# Altium project HW_FPGA_Board.PrjPcb (part 1 of 2)
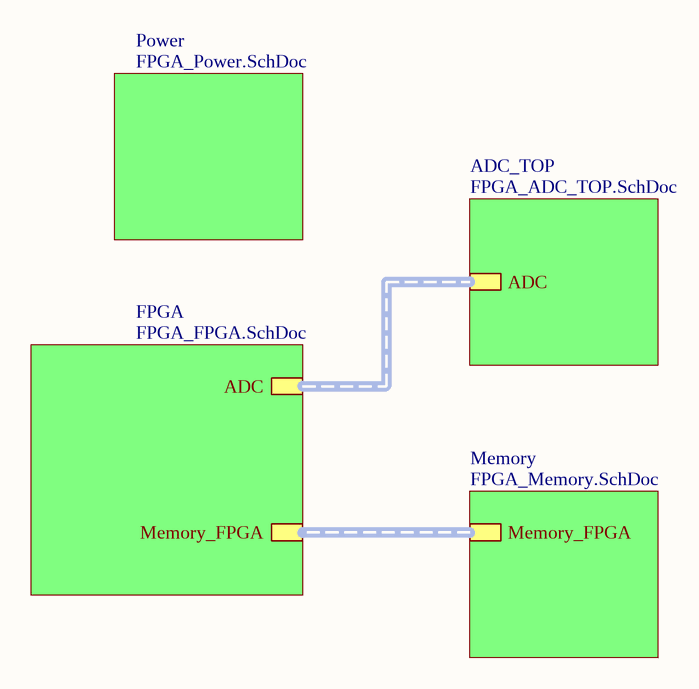
[diagram p0: FPGA_Top.SchDoc]
10 sheets, 242 parts. Net scope: hierarchical (ports join the sheet entries above them; power ports are global).
Board file: HW_FPGA_Board.PcbDoc
Sheets:
  FPGA_Top.SchDoc
    Power = FPGA_Power.SchDoc
    FPGA = FPGA_FPGA.SchDoc
      JTAG = FPGA_JTAG.SchDoc
    ADC_TOP = FPGA_ADC_TOP.SchDoc
      ADC1 = FPGA_ADC1.SchDoc
      ADC2 = FPGA_ADC2.SchDoc
      ADC3 = FPGA_ADC3.SchDoc
      ADC4 = FPGA_ADC4.SchDoc
    Memory = FPGA_Memory.SchDoc

## Sheet FPGA_Top.SchDoc
size A4

### Sub-sheets
ADC_TOP = FPGA_ADC_TOP.SchDoc: ADC (harness ADC_BUS)
FPGA = FPGA_FPGA.SchDoc: Memory_FPGA (harness Memory), ADC (harness Memory)
Memory = FPGA_Memory.SchDoc: Memory_FPGA (harness Memory)
Power = FPGA_Power.SchDoc: no entries

### Buses and harness runs
harness sheet ADC_TOP/ADC = sheet FPGA/ADC
harness sheet FPGA/Memory_FPGA = sheet Memory/Memory_FPGA

## Sheet FPGA_Power.SchDoc
size A3
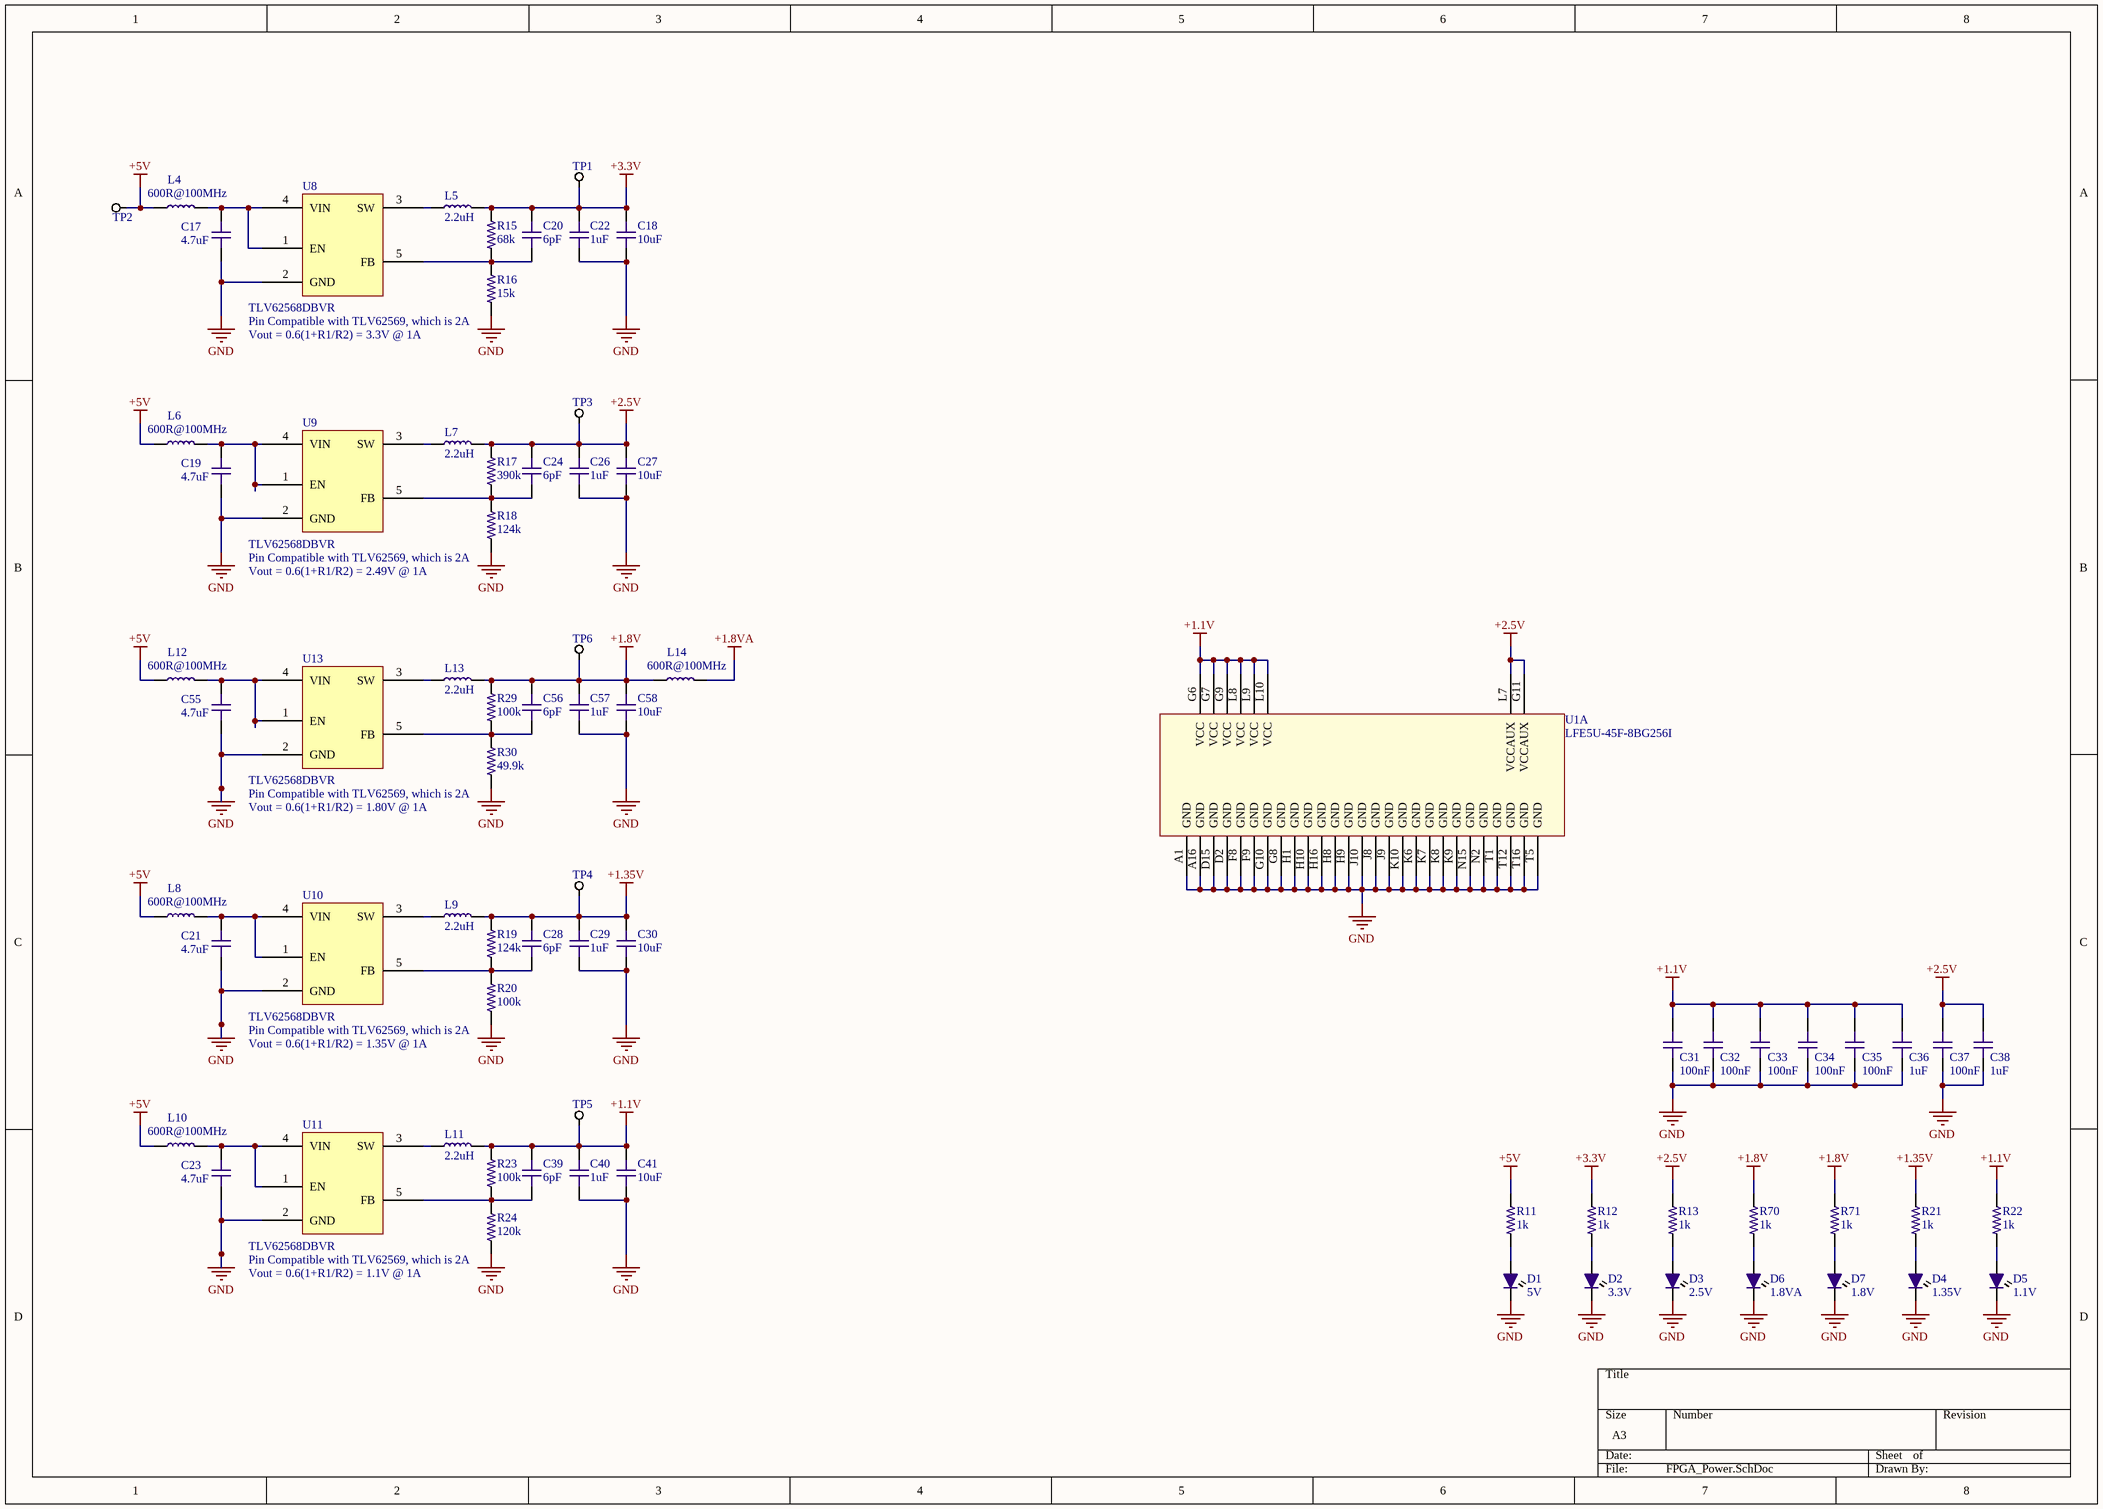
[diagram p1: FPGA_Power.SchDoc]

### Parts
C17  value 4.7uF  [C0603-HIGH-DENSITY]  (hidden comment: 4.7uF, 25V, X5R, 0603)
C18  value 10uF  [C0603-HIGH-DENSITY]  (hidden comment: C0603 10uF 10V X5R)
C19  value 4.7uF  [C0603-HIGH-DENSITY]  (hidden comment: 4.7uF, 25V, X5R, 0603)
C20  value 6pF  [C0603-HIGH-DENSITY]  (hidden comment: CL10C060DB8NNNC)
C21  value 4.7uF  [C0603-HIGH-DENSITY]  (hidden comment: 4.7uF, 25V, X5R, 0603)
C22  value 1uF  [C0603-HIGH-DENSITY]  (hidden comment: C0603 1uF 25V X7R)
C23  value 4.7uF  [C0603-HIGH-DENSITY]  (hidden comment: 4.7uF, 25V, X5R, 0603)
C24  value 6pF  [C0603-HIGH-DENSITY]  (hidden comment: CL10C060DB8NNNC)
C26  value 1uF  [C0603-HIGH-DENSITY]  (hidden comment: C0603 1uF 25V X7R)
C27  value 10uF  [C0603-HIGH-DENSITY]  (hidden comment: C0603 10uF 10V X5R)
C28  value 6pF  [C0603-HIGH-DENSITY]  (hidden comment: CL10C060DB8NNNC)
C29  value 1uF  [C0603-HIGH-DENSITY]  (hidden comment: C0603 1uF 25V X7R)
C30  value 10uF  [C0603-HIGH-DENSITY]  (hidden comment: C0603 10uF 10V X5R)
C31  value 100nF  [C0603-HIGH-DENSITY]  (hidden comment: C0603 100nF 25V X7R)
C32  value 100nF  [C0603-HIGH-DENSITY]  (hidden comment: C0603 100nF 25V X7R)
C33  value 100nF  [C0603-HIGH-DENSITY]  (hidden comment: C0603 100nF 25V X7R)
C34  value 100nF  [C0603-HIGH-DENSITY]  (hidden comment: C0603 100nF 25V X7R)
C35  value 100nF  [C0603-HIGH-DENSITY]  (hidden comment: C0603 100nF 25V X7R)
C36  value 1uF  [C0603-HIGH-DENSITY]  (hidden comment: C0603 1uF 25V X7R)
C37  value 100nF  [C0603-HIGH-DENSITY]  (hidden comment: C0603 100nF 25V X7R)
C38  value 1uF  [C0603-HIGH-DENSITY]  (hidden comment: C0603 1uF 25V X7R)
C39  value 6pF  [C0603-HIGH-DENSITY]  (hidden comment: CL10C060DB8NNNC)
C40  value 1uF  [C0603-HIGH-DENSITY]  (hidden comment: C0603 1uF 25V X7R)
C41  value 10uF  [C0603-HIGH-DENSITY]  (hidden comment: C0603 10uF 10V X5R)
C55  value 4.7uF  [C0603-HIGH-DENSITY]  (hidden comment: 4.7uF, 25V, X5R, 0603)
C56  value 6pF  [C0603-HIGH-DENSITY]  (hidden comment: CL10C060DB8NNNC)
C57  value 1uF  [C0603-HIGH-DENSITY]  (hidden comment: C0603 1uF 25V X7R)
C58  value 10uF  [C0603-HIGH-DENSITY]  (hidden comment: C0603 10uF 10V X5R)
D1  5V  [LED0603-IPC]
D2  3.3V  [LED0603-IPC]
D3  2.5V  [LED0603-IPC]
D4  1.35V  [LED0603-IPC]
D5  1.1V  [LED0603-IPC]
D6  1.8VA  [LED0603-IPC]
D7  1.8V  [LED0603-IPC]
L4  value 600R@100MHz  [L0603]  (hidden comment: Ferrite Bead)
L5  value 2.2uH  [L1008]  (hidden comment: SDEM25201B-2R2MS)
L6  value 600R@100MHz  [L0603]  (hidden comment: Ferrite Bead)
L7  value 2.2uH  [L1008]  (hidden comment: SDEM25201B-2R2MS)
L8  value 600R@100MHz  [L0603]  (hidden comment: Ferrite Bead)
L9  value 2.2uH  [L1008]  (hidden comment: SDEM25201B-2R2MS)
L10  value 600R@100MHz  [L0603]  (hidden comment: Ferrite Bead)
L11  value 2.2uH  [L1008]  (hidden comment: SDEM25201B-2R2MS)
L12  value 600R@100MHz  [L0603]  (hidden comment: Ferrite Bead)
L13  value 2.2uH  [L1008]  (hidden comment: SDEM25201B-2R2MS)
L14  value 600R@100MHz  [L0603]  (hidden comment: Ferrite Bead)
R11  value 1k  [R0603-IPC-1K]  (hidden comment: R0603 1K 1%)
R12  value 1k  [R0603-IPC-1K]  (hidden comment: R0603 1K 1%)
R13  value 1k  [R0603-IPC-1K]  (hidden comment: R0603 1K 1%)
R15  value 68k  [R0603-HIGH-DENSITY]  (hidden comment: R0603 68K 1%)
R16  value 15k  [R0603-HIGH-DENSITY]  (hidden comment: R0603 15K 1%)
R17  value 390k  [R0603-HIGH-DENSITY]  (hidden comment: R0603 390k 0.1%)
R18  value 124k  [R0603-HIGH-DENSITY]  (hidden comment: R0603 124K 1%)
R19  value 124k  [R0603-HIGH-DENSITY]  (hidden comment: R0603 124K 1%)
R20  value 100k  [R0603-HIGH-DENSITY]  (hidden comment: R0603 100K 1%)
R21  value 1k  [R0603-IPC-1K]  (hidden comment: R0603 1K 1%)
R22  value 1k  [R0603-IPC-1K]  (hidden comment: R0603 1K 1%)
R23  value 100k  [R0603-HIGH-DENSITY]  (hidden comment: R0603 100K 1%)
R24  value 120k  [R0603-HIGH-DENSITY]  (hidden comment: R0603 120k 1%)
R29  value 100k  [R0603-HIGH-DENSITY]  (hidden comment: R0603 100K 1%)
R30  value 49.9k  [R0603-HIGH-DENSITY]  (hidden comment: R0603 49.9K 1%)
R70  value 1k  [R0603-IPC-1K]  (hidden comment: R0603 1K 1%)
R71  value 1k  [R0603-IPC-1K]  (hidden comment: R0603 1K 1%)
TP1  3V3  [Testpoint_TH]  (value not drawn)
TP2  5V0  [Testpoint_TH]  (value not drawn)
TP3  2V5  [Testpoint_TH]  (value not drawn)
TP4  1V35  [Testpoint_TH]  (value not drawn)
TP5  1V1  [Testpoint_TH]  (value not drawn)
TP6  1V8  [Testpoint_TH]  (value not drawn)
U1  LFE5U-45F-8BG256I  [caBGA256]  (part A of 9)
U8  TLV62568DBVR  [DBV0005A]
U9  TLV62568DBVR  [DBV0005A]
U10  TLV62568DBVR  [DBV0005A]
U11  TLV62568DBVR  [DBV0005A]
U13  TLV62568DBVR  [DBV0005A]

### Nets
+1.1V: C31.2 C32.2 C33.2 C34.2 C35.2 C36.2 C39.2 C40.2 C41.2 L11.2 R22.2 R23.2 TP5.1 U1.G6(VCC) U1.G7(VCC) U1.G9(VCC) U1.L8(VCC) U1.L9(VCC) U1.L10(VCC)
+1.8V: C56.2 C57.2 C58.2 L13.2 L14.1 R29.2 R70.2 R71.2 TP6.1
+1.8VA: L14.2
+1.35V: C28.2 C29.2 C30.2 L9.2 R19.2 R21.2 TP4.1
+2.5V: C24.2 C26.2 C27.2 C37.2 C38.2 L7.2 R13.2 R17.2 TP3.1 U1.G11(VCCAUX) U1.L7(VCCAUX)
+3.3V: C18.2 C20.2 C22.2 L5.2 R12.2 R15.2 TP1.1
+5V: L4.1 L6.1 L8.1 L10.1 L12.1 R11.2 TP2.1
GND: C17.1 C18.1 C19.1 C21.1 C22.1 C23.1 C26.1 C27.1 C29.1 C30.1 C31.1 C32.1 C33.1 C34.1 C35.1 C36.1 C37.1 C38.1 C40.1 C41.1 C55.1 C57.1 C58.1 D1.K D2.K D3.K D4.K D5.K D6.K D7.K R16.1 R18.1 R20.1 R24.1 R30.1 U1.A1(GND) U1.A16(GND) U1.D2(GND) U1.D15(GND) U1.F8(GND) U1.F9(GND) U1.G8(GND) U1.G10(GND) U1.H1(GND) U1.H8(GND) U1.H9(GND) U1.H10(GND) U1.H16(GND) U1.J8(GND) U1.J9(GND) U1.J10(GND) U1.K6(GND) U1.K7(GND) U1.K8(GND) U1.K9(GND) U1.K10(GND) U1.N2(GND) U1.N15(GND) U1.T1(GND) U1.T5(GND) U1.T12(GND) U1.T16(GND) U8.2(GND) U9.2(GND) U10.2(GND) U11.2(GND) U13.2(GND)
NetC17_2: C17.2 L4.2 U8.1(EN) U8.4(VIN)
NetC19_2: C19.2 L6.2 U9.1(EN) U9.4(VIN)
NetC20_1: C20.1 R15.1 R16.2 U8.5(FB)
NetC21_2: C21.2 L8.2 U10.1(EN) U10.4(VIN)
NetC23_2: C23.2 L10.2 U11.1(EN) U11.4(VIN)
NetC24_1: C24.1 R17.1 R18.2 U9.5(FB)
NetC28_1: C28.1 R19.1 R20.2 U10.5(FB)
NetC39_1: C39.1 R23.1 R24.2 U11.5(FB)
NetC55_2: C55.2 L12.2 U13.1(EN) U13.4(VIN)
NetC56_1: C56.1 R29.1 R30.2 U13.5(FB)
NetD1_A: D1.A R11.1
NetD2_A: D2.A R12.1
NetD3_A: D3.A R13.1
NetD4_A: D4.A R21.1
NetD5_A: D5.A R22.1
NetD6_A: D6.A R70.1
NetD7_A: D7.A R71.1
NetL5_1: L5.1 U8.3(SW)
NetL7_1: L7.1 U9.3(SW)
NetL9_1: L9.1 U10.3(SW)
NetL11_1: L11.1 U11.3(SW)
NetL13_1: L13.1 U13.3(SW)

### Notes on the sheet
- Vout = 0.6(1+R1/R2) = 3.3V @ 1A
- (near R16) Pin Compatible with TLV62569, which is 2A
- Vout = 0.6(1+R1/R2) = 2.49V @ 1A
- (near R18) Pin Compatible with TLV62569, which is 2A
- Vout = 0.6(1+R1/R2) = 1.80V @ 1A
- (near R30) Pin Compatible with TLV62569, which is 2A
- Vout = 0.6(1+R1/R2) = 1.35V @ 1A
- (near R20) Pin Compatible with TLV62569, which is 2A
- (near R24) Pin Compatible with TLV62569, which is 2A
- Vout = 0.6(1+R1/R2) = 1.1V @ 1A

### Library data of the parts
C17 C19 C21 C23 C55 = C0603 4.7uF 25V X5R: Chip Capacitor, 0603, 4.7uF, 25V, X5R; EIA Code: X5R; Max. Voltage: 25V; Supplier 1: Digi-Key; Supplier 2: Mouser; Supplier 3: LCSC; Supplier Part Number 1: 490-7203-1-ND; Supplier Part Number 2: 81-GRM188R61E475KE1D; Supplier Part Number 3: C90057
C18 C27 C30 C41 C58 = C0603 10uF 10V X5R: Chip Capacitor, 0603, 10uF, 10V, X5R; EIA Code: X7R; Max. Voltage: 10V; Supplier 1: Digi-Key; Supplier Part Number 1: 490-10474-1-ND
C20 C24 C28 C39 C56 = C0603 6pF 50V C0G: CAP CER 6PF 50V C0G/NP0 0603; EIA Code: C0G; Max. Voltage: 50V; Supplier 1: Digi-Key; Supplier 2: Mouser; Supplier 3: LCSC; Supplier Part Number 1: 1276-2134-1-ND; Supplier Part Number 2: 187-CL10C060DB8NNNC; Supplier Part Number 3: C170142
C22 C26 C29 C36 C38 C40 C57 = C0603 1uF 25V X7R: CAP CER 1UF 25V X7R 0603; EIA Code: X7R; Max. Voltage: 25V; Features: Soft Termination; Supplier 1: Digi-Key; Supplier Part Number 1: 445-173615-1-ND
C31-C35 C37 = C0603 100nF 25V X7R: Chip Capacitor, 0603, 100nF, 25V, X7R; EIA Code: X7R; Max. Voltage: 25V; Supplier 1: Digi-Key; Supplier Part Number 1: 490-1524-1-ND
D1-D7 = LED 0603 Green: LED GREEN CLEAR 0603 SMD; Supplier 1: Digi-Key; Supplier Part Number 1: 732-4971-1-ND
L4 L6 L8 L10 L12 L14 = FB 0603 600R @ 100MHz: 600 Ohms @ 100MHz 1 Ferrite Bead 0603 (1608 Metric) 500mA 380mOhm; Supplier 1: Digi-Key; Supplier Part Number 1: 490-1014-1-ND
L5 L7 L9 L11 L13 = SDEM25201B-2R2MS: 2.2µH Shielded Inductor 2.05A 117mOhm Max 1008 (2520 Metric); Supplier 1: Digi-Key; Supplier Part Number 1: 2037-SDEM25201B-2R2MSCT-ND
R11-R13 R21 R22 R70 R71 = R0603 1K 1%: RES SMD 1K OHM 1% 1/10W 0603; Temperature Coefficient: ±100ppm/°C; Operating Temperature: -55°C ~ 155°C; Features: Automotive AEC-Q200; Tolerance: ±1%; Supplier 1: Digi-Key; Supplier Part Number 1: RMCF0603FG1K00CT-ND
R15 = R0603 68K 0.1%: RES SMD 68K OHM 1% 1/5W 0603; Supplier 1: Digi-Key; Supplier Part Number 1: P20181CT-ND
R16 = R0603 15K 1%: RES SMD 15K OHM 1% 1/10W 0603; Supplier 1: Digi-Key; Supplier Part Number 1: RMCF0603FT15K0CT-ND
R17 = R0603 390k 0.1%: RES SMD 390K OHM 0.1% 1/10W 0603; Supplier 1: Digi-Key; Supplier Part Number 1: YAG4542CT-ND
R18 R19 = R0603 124K 1%: RES SMD 124K OHM 1% 1/10W 0603; Supplier 1: Digi-Key; Supplier Part Number 1: RMCF0603FT124KCT-ND
R20 R23 R29 = R0603 100K 1%: RES SMD 100K OHM 1% 1/10W 0603; Supplier 1: Digi-Key; Supplier Part Number 1: RMCF0603FT100KCT-ND
R24 = R0603 120k 1%: RES SMD 120K OHM 1% 1/10W 0603; Power: 0.1W; Temperature Coefficient: ±100ppm/°C; Supplier 1: Digi-Key; Tolerance: ±1%; Features: Automotive AEC-Q200; Operating Temperature: -55°C ~ 155°C; Supplier Part Number 1: RMCF0603FT120KCT-ND
R30 = R0603 49.9K 1%: RES SMD 49.9K OHM 1% 1/10W 0603; Temperature Coefficient: ±100ppm/°C; Features: Automotive AEC-Q200; Operating Temperature: -55°C ~ 155°C; Tolerance: ±1%; Supplier 1: Digi-Key; Supplier Part Number 1: RMCF0603FT49K9CT-ND
TP1-TP6 = Testpoint_TH: Through-hole testpoint hook
U1 = ECP5-45F-CABGA256: Lattice ECP5 45k LUTs / IC FPGA 197 I/O 256CABGA; Supplier 1: Digi-Key; Supplier 2: Mouser; Supplier Part Number 1: 220-2201-ND; Supplier Part Number 2: 842-LFE5U45F8BG256I
U8-U11 U13 = TLV62568: IC REG BUCK ADJ 1A SOT23-5; Supplier 1: Digi-Key; Supplier Part Number 1: 296-47359-1-ND

## Sheet FPGA_FPGA.SchDoc
size A2
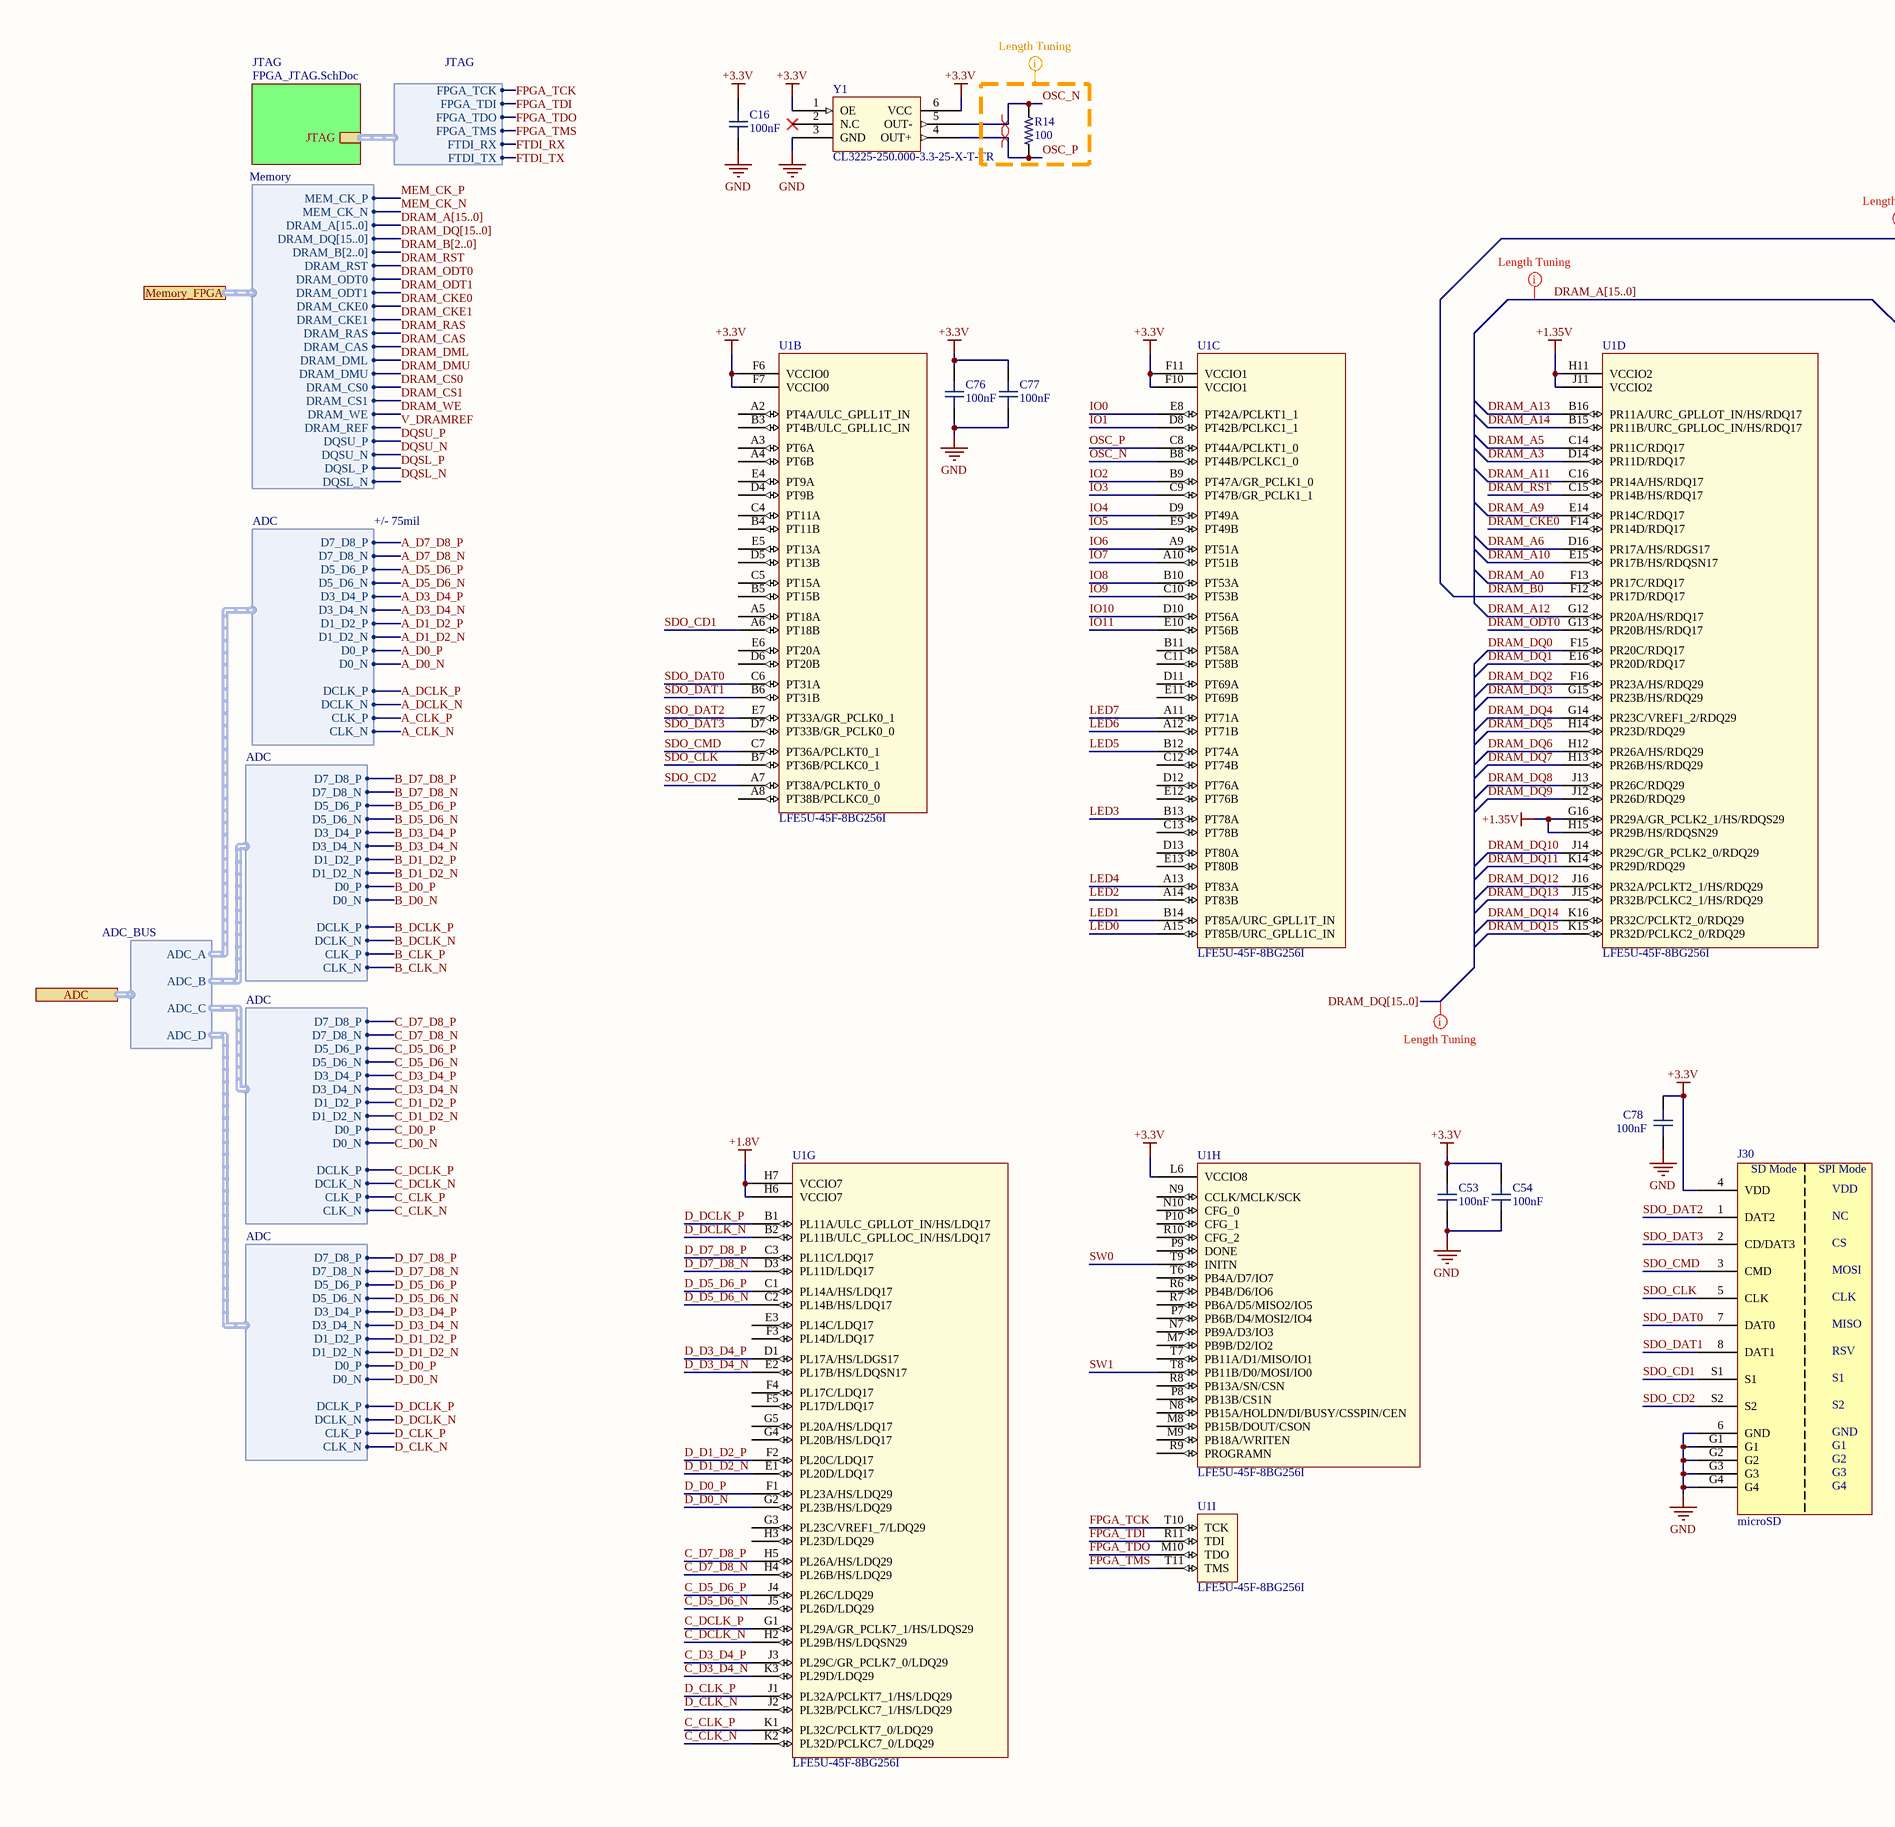
[diagram p2: FPGA_FPGA.SchDoc, left]
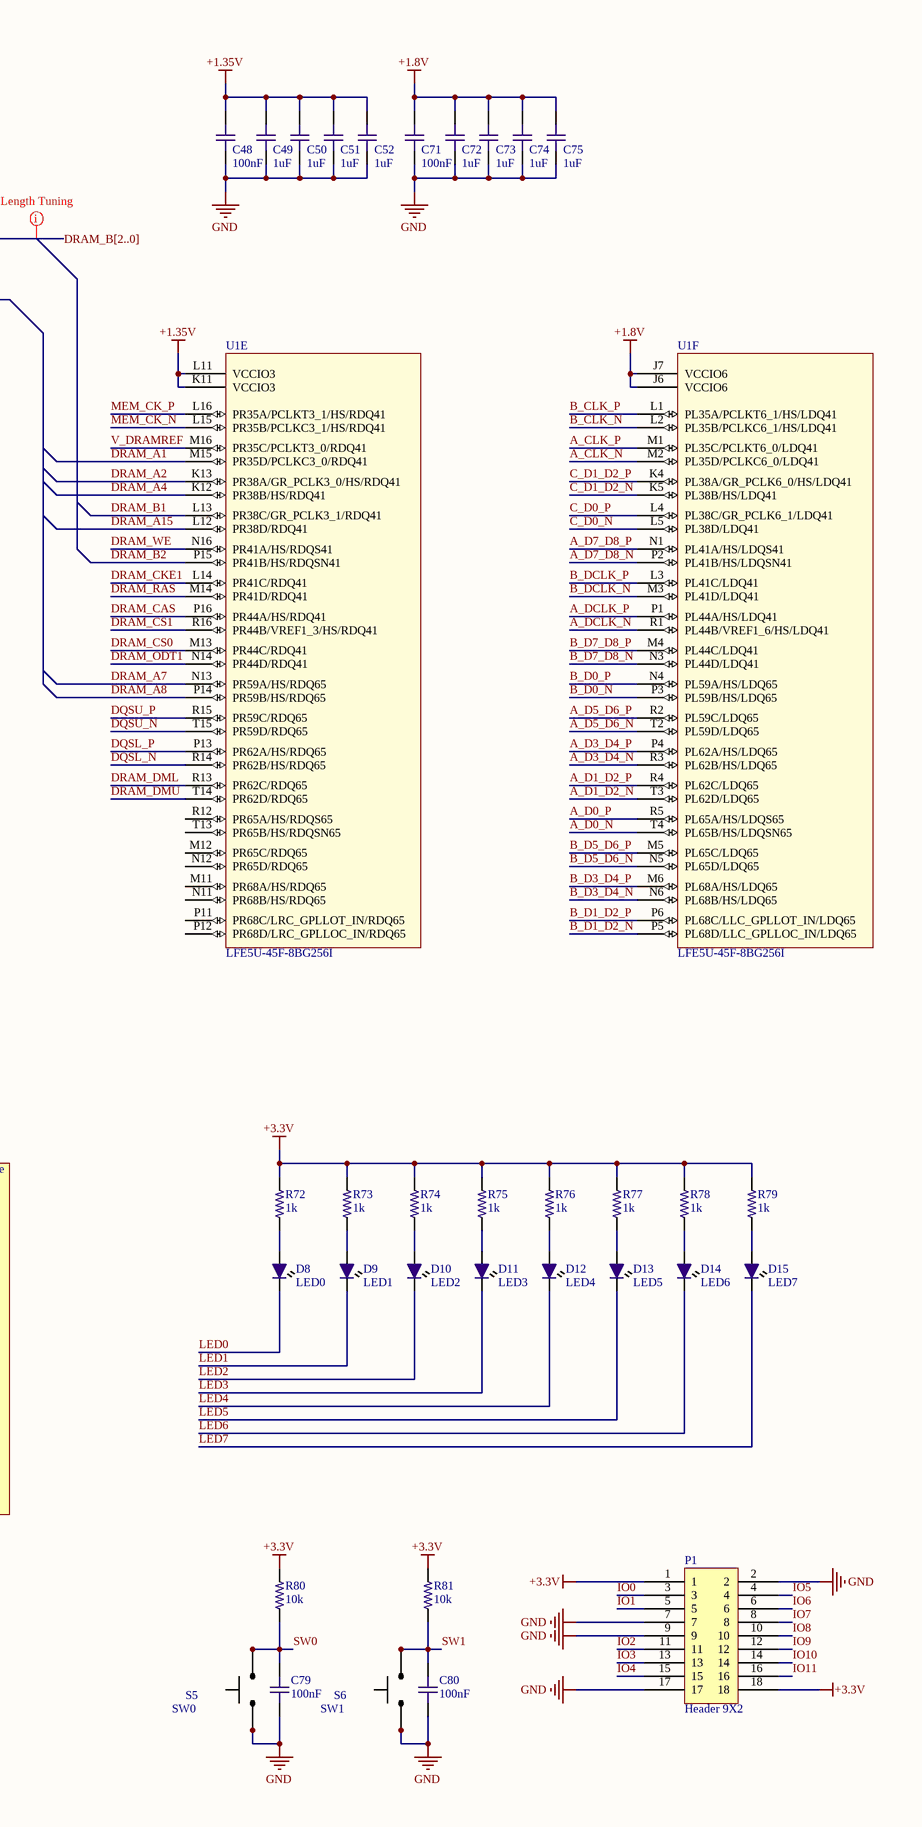
[diagram p3: FPGA_FPGA.SchDoc, right]

### Parts
C16  value 100nF  [C0603-HIGH-DENSITY]  (hidden comment: C0603 100nF 25V X7R)
C48  value 100nF  [C0603-HIGH-DENSITY]  (hidden comment: C0603 100nF 25V X7R)
C49  value 1uF  [C0603-HIGH-DENSITY]  (hidden comment: C0603 1uF 25V X7R)
C50  value 1uF  [C0603-HIGH-DENSITY]  (hidden comment: C0603 1uF 25V X7R)
C51  value 1uF  [C0603-HIGH-DENSITY]  (hidden comment: C0603 1uF 25V X7R)
C52  value 1uF  [C0603-HIGH-DENSITY]  (hidden comment: C0603 1uF 25V X7R)
C53  value 100nF  [C0603-HIGH-DENSITY]  (hidden comment: C0603 100nF 25V X7R)
C54  value 100nF  [C0603-HIGH-DENSITY]  (hidden comment: C0603 100nF 25V X7R)
C71  value 100nF  [C0603-HIGH-DENSITY]  (hidden comment: C0603 100nF 25V X7R)
C72  value 1uF  [C0603-HIGH-DENSITY]  (hidden comment: C0603 1uF 25V X7R)
C73  value 1uF  [C0603-HIGH-DENSITY]  (hidden comment: C0603 1uF 25V X7R)
C74  value 1uF  [C0603-HIGH-DENSITY]  (hidden comment: C0603 1uF 25V X7R)
C75  value 1uF  [C0603-HIGH-DENSITY]  (hidden comment: C0603 1uF 25V X7R)
C76  value 100nF  [C0603-HIGH-DENSITY]  (hidden comment: C0603 100nF 25V X7R)
C77  value 100nF  [C0603-HIGH-DENSITY]  (hidden comment: C0603 100nF 25V X7R)
C78  value 100nF  [C0603-HIGH-DENSITY]  (hidden comment: C0603 100nF 25V X7R)
C79  value 100nF  [C0603-HIGH-DENSITY]  (hidden comment: C0603 100nF 25V X7R)
C80  value 100nF  [C0603-HIGH-DENSITY]  (hidden comment: C0603 100nF 25V X7R)
D8  LED0  [LED0603-IPC]
D9  LED1  [LED0603-IPC]
D10  LED2  [LED0603-IPC]
D11  LED3  [LED0603-IPC]
D12  LED4  [LED0603-IPC]
D13  LED5  [LED0603-IPC]
D14  LED6  [LED0603-IPC]
D15  LED7  [LED0603-IPC]
J30  microSD  [1040310811]
P1  Header 9X2  [Header 9X2]
R14  value 100  [R0402-HIGH-DENSITY]  (hidden comment: R0402 100R 1%)
R72  value 1k  [R0603-IPC]  (hidden comment: R0603 1K 1%)
R73  value 1k  [R0603-IPC]  (hidden comment: R0603 1K 1%)
R74  value 1k  [R0603-IPC]  (hidden comment: R0603 1K 1%)
R75  value 1k  [R0603-IPC]  (hidden comment: R0603 1K 1%)
R76  value 1k  [R0603-IPC]  (hidden comment: R0603 1K 1%)
R77  value 1k  [R0603-IPC]  (hidden comment: R0603 1K 1%)
R78  value 1k  [R0603-IPC]  (hidden comment: R0603 1K 1%)
R79  value 1k  [R0603-IPC]  (hidden comment: R0603 1K 1%)
R80  value 10k  [R0603-IPC]  (hidden comment: R0603 10K 1%)
R81  value 10k  [R0603-IPC]  (hidden comment: R0603 10K 1%)
S5  SW0  [TL3342F260QG]
S6  SW1  [TL3342F260QG]
U1  LFE5U-45F-8BG256I  [caBGA256]  (parts B,C,D,E,F,G,H,I of 9)
Y1  CL3225-250.000-3.3-25-X-T-TR  [Raltron CL3225]

### Sub-sheets
JTAG = FPGA_JTAG.SchDoc: JTAG (harness JTAG)

### Ports
ADC (harness ADC_BUS), Memory_FPGA (harness Memory)

### Harnesses
JTAG: FPGA_TCK, FPGA_TDI, FPGA_TDO, FPGA_TMS, FTDI_RX, FTDI_TX
ADC_BUS: ADC_A, ADC_B, ADC_C, ADC_D
ADC: D7_D8_P, D7_D8_N, D5_D6_P, D5_D6_N, D3_D4_P, D3_D4_N, D1_D2_P, D1_D2_N, D0_P, D0_N, CLK_P, CLK_N, DCLK_P, DCLK_N
Memory: MEM_CK_P, MEM_CK_N, DRAM_A[15..0], DRAM_DQ[15..0], DRAM_B[2..0], DRAM_RST, DRAM_ODT0, DRAM_ODT1, DRAM_CKE0, DRAM_CKE1, DRAM_RAS, DRAM_CAS, DRAM_DML, DRAM_DMU, DRAM_CS0, DRAM_CS1, DRAM_WE, DRAM_REF, DQSU_P, DQSU_N, DQSL_P, DQSL_N

### Nets
+1.8V: C71.2 C72.2 C73.2 C74.2 C75.2 U1.H6(VCCIO7) U1.H7(VCCIO7) U1.J6(VCCIO6) U1.J7(VCCIO6)
+1.35V: C48.2 C49.2 C50.2 C51.2 C52.2 U1.G16(PR29A/GR_PCLK2_1/HS/RDQS29) U1.H11(VCCIO2) U1.H15(PR29B/HS/RDQSN29) U1.J11(VCCIO2) U1.K11(VCCIO3) U1.L11(VCCIO3)
+3.3V: C16.2 C53.2 C54.2 C76.2 C77.2 C78.1 J30.4(VDD) P1.1 P1.18 R72.2 R73.2 R74.2 R75.2 R76.2 R77.2 R78.2 R79.2 R80.2 R81.2 U1.F6(VCCIO0) U1.F7(VCCIO0) U1.F10(VCCIO1) U1.F11(VCCIO1) U1.L6(VCCIO8) Y1.1(OE) Y1.6(VCC)
GND: C16.1 C48.1 C49.1 C50.1 C51.1 C52.1 C53.1 C54.1 C71.1 C72.1 C73.1 C74.1 C75.1 C76.1 C77.1 C78.2 C79.1 C80.1 J30.6(GND) J30.G1 J30.G2 J30.G3 J30.G4 P1.2 P1.7 P1.9 P1.17 S5.3 S5.4 S6.3 S6.4 Y1.3(GND)
A_CLK_N: U1.M2(PL35D/PCLKC6_0/LDQ41) ; harness ADC.CLK_N
A_CLK_P: U1.M1(PL35C/PCLKT6_0/LDQ41) ; harness ADC.CLK_P
A_D0_N: U1.T4(PL65B/HS/LDQSN65) ; harness ADC.D0_N
A_D0_P: U1.R5(PL65A/HS/LDQS65) ; harness ADC.D0_P
A_D1_D2_N: U1.T3(PL62D/LDQ65) ; harness ADC.D1_D2_N
A_D1_D2_P: U1.R4(PL62C/LDQ65) ; harness ADC.D1_D2_P
A_D3_D4_N: U1.R3(PL62B/HS/LDQ65) ; harness ADC.D3_D4_N
A_D3_D4_P: U1.P4(PL62A/HS/LDQ65) ; harness ADC.D3_D4_P
A_D5_D6_N: U1.T2(PL59D/LDQ65) ; harness ADC.D5_D6_N
A_D5_D6_P: U1.R2(PL59C/LDQ65) ; harness ADC.D5_D6_P
A_D7_D8_N: U1.P2(PL41B/HS/LDQSN41) ; harness ADC.D7_D8_N
A_D7_D8_P: U1.N1(PL41A/HS/LDQS41) ; harness ADC.D7_D8_P
A_DCLK_N: U1.R1(PL44B/VREF1_6/HS/LDQ41) ; harness ADC.DCLK_N
A_DCLK_P: U1.P1(PL44A/HS/LDQ41) ; harness ADC.DCLK_P
B_CLK_N: U1.L2(PL35B/PCLKC6_1/HS/LDQ41) ; harness ADC.CLK_N
B_CLK_P: U1.L1(PL35A/PCLKT6_1/HS/LDQ41) ; harness ADC.CLK_P
B_D0_N: U1.P3(PL59B/HS/LDQ65) ; harness ADC.D0_N
B_D0_P: U1.N4(PL59A/HS/LDQ65) ; harness ADC.D0_P
B_D1_D2_N: U1.P5(PL68D/LLC_GPLLOC_IN/LDQ65) ; harness ADC.D1_D2_N
B_D1_D2_P: U1.P6(PL68C/LLC_GPLLOT_IN/LDQ65) ; harness ADC.D1_D2_P
B_D3_D4_N: U1.N6(PL68B/HS/LDQ65) ; harness ADC.D3_D4_N
B_D3_D4_P: U1.M6(PL68A/HS/LDQ65) ; harness ADC.D3_D4_P
B_D5_D6_N: U1.N5(PL65D/LDQ65) ; harness ADC.D5_D6_N
B_D5_D6_P: U1.M5(PL65C/LDQ65) ; harness ADC.D5_D6_P
B_D7_D8_N: U1.N3(PL44D/LDQ41) ; harness ADC.D7_D8_N
B_D7_D8_P: U1.M4(PL44C/LDQ41) ; harness ADC.D7_D8_P
B_DCLK_N: U1.M3(PL41D/LDQ41) ; harness ADC.DCLK_N
B_DCLK_P: U1.L3(PL41C/LDQ41) ; harness ADC.DCLK_P
C_CLK_N: U1.K2(PL32D/PCLKC7_0/LDQ29) ; harness ADC.CLK_N
C_CLK_P: U1.K1(PL32C/PCLKT7_0/LDQ29) ; harness ADC.CLK_P
C_D0_N: U1.L5(PL38D/LDQ41) ; harness ADC.D0_N
C_D0_P: U1.L4(PL38C/GR_PCLK6_1/LDQ41) ; harness ADC.D0_P
C_D1_D2_N: U1.K5(PL38B/HS/LDQ41) ; harness ADC.D1_D2_N
C_D1_D2_P: U1.K4(PL38A/GR_PCLK6_0/HS/LDQ41) ; harness ADC.D1_D2_P
C_D3_D4_N: U1.K3(PL29D/LDQ29) ; harness ADC.D3_D4_N
C_D3_D4_P: U1.J3(PL29C/GR_PCLK7_0/LDQ29) ; harness ADC.D3_D4_P
C_D5_D6_N: U1.J5(PL26D/LDQ29) ; harness ADC.D5_D6_N
C_D5_D6_P: U1.J4(PL26C/LDQ29) ; harness ADC.D5_D6_P
C_D7_D8_N: U1.H4(PL26B/HS/LDQ29) ; harness ADC.D7_D8_N
C_D7_D8_P: U1.H5(PL26A/HS/LDQ29) ; harness ADC.D7_D8_P
C_DCLK_N: U1.H2(PL29B/HS/LDQSN29) ; harness ADC.DCLK_N
C_DCLK_P: U1.G1(PL29A/GR_PCLK7_1/HS/LDQS29) ; harness ADC.DCLK_P
D_CLK_N: U1.J2(PL32B/PCLKC7_1/HS/LDQ29) ; harness ADC.CLK_N
D_CLK_P: U1.J1(PL32A/PCLKT7_1/HS/LDQ29) ; harness ADC.CLK_P
D_D0_N: U1.G2(PL23B/HS/LDQ29) ; harness ADC.D0_N
D_D0_P: U1.F1(PL23A/HS/LDQ29) ; harness ADC.D0_P
D_D1_D2_N: U1.E1(PL20D/LDQ17) ; harness ADC.D1_D2_N
D_D1_D2_P: U1.F2(PL20C/LDQ17) ; harness ADC.D1_D2_P
D_D3_D4_N: U1.E2(PL17B/HS/LDQSN17) ; harness ADC.D3_D4_N
D_D3_D4_P: U1.D1(PL17A/HS/LDGS17) ; harness ADC.D3_D4_P
D_D5_D6_N: U1.C2(PL14B/HS/LDQ17) ; harness ADC.D5_D6_N
D_D5_D6_P: U1.C1(PL14A/HS/LDQ17) ; harness ADC.D5_D6_P
D_D7_D8_N: U1.D3(PL11D/LDQ17) ; harness ADC.D7_D8_N
D_D7_D8_P: U1.C3(PL11C/LDQ17) ; harness ADC.D7_D8_P
D_DCLK_N: U1.B2(PL11B/ULC_GPLLOC_IN/HS/LDQ17) ; harness ADC.DCLK_N
D_DCLK_P: U1.B1(PL11A/ULC_GPLLOT_IN/HS/LDQ17) ; harness ADC.DCLK_P
DQSL_N: U1.R14(PR62B/HS/RDQ65) ; port Memory_FPGA.DQSL_N
DQSL_P: U1.P13(PR62A/HS/RDQ65) ; port Memory_FPGA.DQSL_P
DQSU_N: U1.T15(PR59D/RDQ65) ; port Memory_FPGA.DQSU_N
DQSU_P: U1.R15(PR59C/RDQ65) ; port Memory_FPGA.DQSU_P
DRAM_A0: U1.F13(PR17C/RDQ17)
DRAM_A1: U1.M15(PR35D/PCLKC3_0/RDQ41)
DRAM_A2: U1.K13(PR38A/GR_PCLK3_0/HS/RDQ41)
DRAM_A3: U1.D14(PR11D/RDQ17)
DRAM_A4: U1.K12(PR38B/HS/RDQ41)
DRAM_A5: U1.C14(PR11C/RDQ17)
DRAM_A6: U1.D16(PR17A/HS/RDGS17)
DRAM_A7: U1.N13(PR59A/HS/RDQ65)
DRAM_A8: U1.P14(PR59B/HS/RDQ65)
DRAM_A9: U1.E14(PR14C/RDQ17)
DRAM_A10: U1.E15(PR17B/HS/RDQSN17)
DRAM_A11: U1.C16(PR14A/HS/RDQ17)
DRAM_A12: U1.G12(PR20A/HS/RDQ17)
DRAM_A13: U1.B16(PR11A/URC_GPLLOT_IN/HS/RDQ17)
DRAM_A14: U1.B15(PR11B/URC_GPLLOC_IN/HS/RDQ17)
DRAM_A15: U1.L12(PR38D/RDQ41)
DRAM_B0: U1.F12(PR17D/RDQ17)
DRAM_B1: U1.L13(PR38C/GR_PCLK3_1/RDQ41)
DRAM_B2: U1.P15(PR41B/HS/RDQSN41)
DRAM_CAS: U1.P16(PR44A/HS/RDQ41) ; port Memory_FPGA.DRAM_CAS
DRAM_CKE0: U1.F14(PR14D/RDQ17) ; port Memory_FPGA.DRAM_CKE0
DRAM_CKE1: U1.L14(PR41C/RDQ41) ; port Memory_FPGA.DRAM_CKE1
DRAM_CS0: U1.M13(PR44C/RDQ41) ; port Memory_FPGA.DRAM_CS0
DRAM_CS1: U1.R16(PR44B/VREF1_3/HS/RDQ41) ; port Memory_FPGA.DRAM_CS1
DRAM_DML: U1.R13(PR62C/RDQ65) ; port Memory_FPGA.DRAM_DML
DRAM_DMU: U1.T14(PR62D/RDQ65) ; port Memory_FPGA.DRAM_DMU
DRAM_DQ0: U1.F15(PR20C/RDQ17)
DRAM_DQ1: U1.E16(PR20D/RDQ17)
DRAM_DQ2: U1.F16(PR23A/HS/RDQ29)
DRAM_DQ3: U1.G15(PR23B/HS/RDQ29)
DRAM_DQ4: U1.G14(PR23C/VREF1_2/RDQ29)
DRAM_DQ5: U1.H14(PR23D/RDQ29)
DRAM_DQ6: U1.H12(PR26A/HS/RDQ29)
DRAM_DQ7: U1.H13(PR26B/HS/RDQ29)
DRAM_DQ8: U1.J13(PR26C/RDQ29)
DRAM_DQ9: U1.J12(PR26D/RDQ29)
DRAM_DQ10: U1.J14(PR29C/GR_PCLK2_0/RDQ29)
DRAM_DQ11: U1.K14(PR29D/RDQ29)
DRAM_DQ12: U1.J16(PR32A/PCLKT2_1/HS/RDQ29)
DRAM_DQ13: U1.J15(PR32B/PCLKC2_1/HS/RDQ29)
DRAM_DQ14: U1.K16(PR32C/PCLKT2_0/RDQ29)
DRAM_DQ15: U1.K15(PR32D/PCLKC2_0/RDQ29)
DRAM_ODT0: U1.G13(PR20B/HS/RDQ17) ; port Memory_FPGA.DRAM_ODT0
DRAM_ODT1: U1.N14(PR44D/RDQ41) ; port Memory_FPGA.DRAM_ODT1
DRAM_RAS: U1.M14(PR41D/RDQ41) ; port Memory_FPGA.DRAM_RAS
DRAM_RST: U1.C15(PR14B/HS/RDQ17) ; port Memory_FPGA.DRAM_RST
DRAM_WE: U1.N16(PR41A/HS/RDQS41) ; port Memory_FPGA.DRAM_WE
FPGA_TCK: U1.T10(TCK) ; sheet JTAG/JTAG.FPGA_TCK
FPGA_TDI: U1.R11(TDI) ; sheet JTAG/JTAG.FPGA_TDI
FPGA_TDO: U1.M10(TDO) ; sheet JTAG/JTAG.FPGA_TDO
FPGA_TMS: U1.T11(TMS) ; sheet JTAG/JTAG.FPGA_TMS
IO0: P1.3 U1.E8(PT42A/PCLKT1_1)
IO1: P1.5 U1.D8(PT42B/PCLKC1_1)
IO2: P1.11 U1.B9(PT47A/GR_PCLK1_0)
IO3: P1.13 U1.C9(PT47B/GR_PCLK1_1)
IO4: P1.15 U1.D9(PT49A)
IO5: P1.4 U1.E9(PT49B)
IO6: P1.6 U1.A9(PT51A)
IO7: P1.8 U1.A10(PT51B)
IO8: P1.10 U1.B10(PT53A)
IO9: P1.12 U1.C10(PT53B)
IO10: P1.14 U1.D10(PT56A)
IO11: P1.16 U1.E10(PT56B)
LED0: D8.K U1.A15(PT85B/URC_GPLL1C_IN)
LED1: D9.K U1.B14(PT85A/URC_GPLL1T_IN)
LED2: D10.K U1.A14(PT83B)
LED3: D11.K U1.B13(PT78A)
LED4: D12.K U1.A13(PT83A)
LED5: D13.K U1.B12(PT74A)
LED6: D14.K U1.A12(PT71B)
LED7: D15.K U1.A11(PT71A)
MEM_CK_N: U1.L15(PR35B/PCLKC3_1/HS/RDQ41) ; port Memory_FPGA.MEM_CK_N
MEM_CK_P: U1.L16(PR35A/PCLKT3_1/HS/RDQ41) ; port Memory_FPGA.MEM_CK_P
OSC_N: R14.2 U1.B8(PT44B/PCLKC1_0) Y1.5(OUT-)
OSC_P: R14.1 U1.C8(PT44A/PCLKT1_0) Y1.4(OUT+)
SDO_CD1: J30.S1 U1.A6(PT18B)
SDO_CD2: J30.S2 U1.A7(PT38A/PCLKT0_0)
SDO_CLK: J30.5(CLK) U1.B7(PT36B/PCLKC0_1)
SDO_CMD: J30.3(CMD) U1.C7(PT36A/PCLKT0_1)
SDO_DAT0: J30.7(DAT0) U1.C6(PT31A)
SDO_DAT1: J30.8(DAT1) U1.B6(PT31B)
SDO_DAT2: J30.1(DAT2) U1.E7(PT33A/GR_PCLK0_1)
SDO_DAT3: J30.2(CD/DAT3) U1.D7(PT33B/GR_PCLK0_0)
SW0: C79.2 R80.1 S5.1 S5.2 U1.T9(INITN)
SW1: C80.2 R81.1 S6.1 S6.2 U1.T8(PB11B/D0/MOSI/IO0)
V_DRAMREF: U1.M16(PR35C/PCLKT3_0/RDQ41) ; port Memory_FPGA.DRAM_REF
NetD8_A: D8.A R72.1
NetD9_A: D9.A R73.1
NetD10_A: D10.A R74.1
NetD11_A: D11.A R75.1
NetD12_A: D12.A R76.1
NetD13_A: D13.A R77.1
NetD14_A: D14.A R78.1
NetD15_A: D15.A R79.1

Not connected (* = marked no-connect by the designer): U1 A2(PT4A/ULC_GPLL1T_IN) A3(PT6A) A4(PT6B) A5(PT18A) A8(PT38B/PCLKC0_0) B3(PT4B/ULC_GPLL1C_IN) B4(PT11B) B5(PT15B) B11(PT58A) C4(PT11A) C5(PT15A) C11(PT58B) C12(PT74B) C13(PT78B) D4(PT9B) D5(PT13B) D6(PT20B) D11(PT69A) D12(PT76A) D13(PT80A) E3(PL14C/LDQ17) E4(PT9A) E5(PT13A) E6(PT20A) E11(PT69B) E12(PT76B) E13(PT80B) F3(PL14D/LDQ17) F4(PL17C/LDQ17) F5(PL17D/LDQ17) G3(PL23C/VREF1_7/LDQ29) G4(PL20B/HS/LDQ17) G5(PL20A/HS/LDQ17) H3(PL23D/LDQ29) M7(PB9B/D2/IO2) M8(PB15B/DOUT/CSON) M9(PB18A/WRITEN) M11(PR68A/HS/RDQ65) M12(PR65C/RDQ65) N7(PB9A/D3/IO3) N8(PB15A/HOLDN/DI/BUSY/CSSPIN/CEN) N9(CCLK/MCLK/SCK) N10(CFG_0) N11(PR68B/HS/RDQ65) N12(PR65D/RDQ65) P7(PB6B/D4/MOSI2/IO4) P8(PB13B/CS1N) P9(DONE) P10(CFG_1) P11(PR68C/LRC_GPLLOT_IN/RDQ65) P12(PR68D/LRC_GPLLOC_IN/RDQ65) R6(PB4B/D6/IO6) R7(PB6A/D5/MISO2/IO5) R8(PB13A/SN/CSN) R9(PROGRAMN) R10(CFG_2) R12(PR65A/HS/RDQS65) T6(PB4A/D7/IO7) T7(PB11A/D1/MISO/IO1) T13(PR65B/HS/RDQSN65); Y1 2(N.C)*

### Buses and harness runs
bus DRAM_A[15..0]
bus DRAM_B[2..0]
bus DRAM_DQ[15..0]

### Layout directives
differential pair; net class DIFF100: OSC_N, OSC_P
net class OSC - 37.5mil: OSC_N, OSC_P
net class DRAM_DATA - 150mil: (no net found under the mark)
net class DRAM_B - 150mil: (no net found under the mark)
net class DRAM_ADD - 150mil: (no net found under the mark)

### Notes on the sheet
- +/- 75mil
- (in symbol microSD) SD Mode; SPI Mode; NC; CS; MOSI; MISO; RSV

### Library data of the parts
C16 C48 C53 C54 C71 C76-C80 = C0603 100nF 25V X7R: Chip Capacitor, 0603, 100nF, 25V, X7R; EIA Code: X7R; Max. Voltage: 25V; Supplier 1: Digi-Key; Supplier Part Number 1: 490-1524-1-ND
C49-C52 C72-C75 = C0603 1uF 25V X7R: CAP CER 1UF 25V X7R 0603; EIA Code: X7R; Max. Voltage: 25V; Features: Soft Termination; Supplier 1: Digi-Key; Supplier Part Number 1: 445-173615-1-ND
D8-D15 = LED 0603 Green: LED GREEN CLEAR 0603 SMD; Supplier 1: Digi-Key; Supplier Part Number 1: 732-4971-1-ND
  D8: Value: Green
J30 = microSD: CONN MICRO SD CARD PUSH-PULL R/A; Supplier 1: Digi-Key; Supplier Part Number 1: WM6357CT-ND
P1 = Header 9X2: 0.254mm
R14 = R0402 100R 1%: Chip Resistor, 0402, 100 ohms, 1%, 1/16 W; Supplier 1: Digi-Key; Supplier Part Number 1: 311-100LRCT-ND
R72-R79 = R0603 1K 1%: as R11 on sheet FPGA_Power; Operating Temperature: -55°C ~ 155°C; Features: Automotive AEC-Q200; Tolerance: ±1%; Supplier 1: Digi-Key; Supplier Part Number 1: RMCF0603FG1K00CT-ND
R80 R81 = R0603 10K 1%: RES SMD 10K OHM 1% 1/10W 0603; Supplier 1: Digi-Key; Supplier Part Number 1: RMCF0603FT10K0CT-ND
S5 S6 = SWITCH TACTILE SPST: SWITCH TACTILE SPST-NO 0.05A 12V; Manufacturer Part Number: TL3342F260QG; Supplier 1: Digi-Key; Supplier Part Number 1: EG5470CT-ND
U1 = ECP5-45F-CABGA256: as U1 on sheet FPGA_Power; Supplier 1: Digi-Key; Supplier 2: Mouser; Supplier Part Number 1: 220-2201-ND; Supplier Part Number 2: 842-LFE5U45F8BG256I
Y1 = CL3225-250.000-3.3-25-X-T-TR: 250MHz XO (Standard) LVDS Oscillator 3.3V Enable/Disable 6-SMD, No Lead; MFN: EPSON; Supplier 1: Digi-Key; Supplier Part Number 1: 2151-CL3225-250.000-3.3-25-X-T-TRCT-ND

## Sheet FPGA_JTAG.SchDoc
size A4
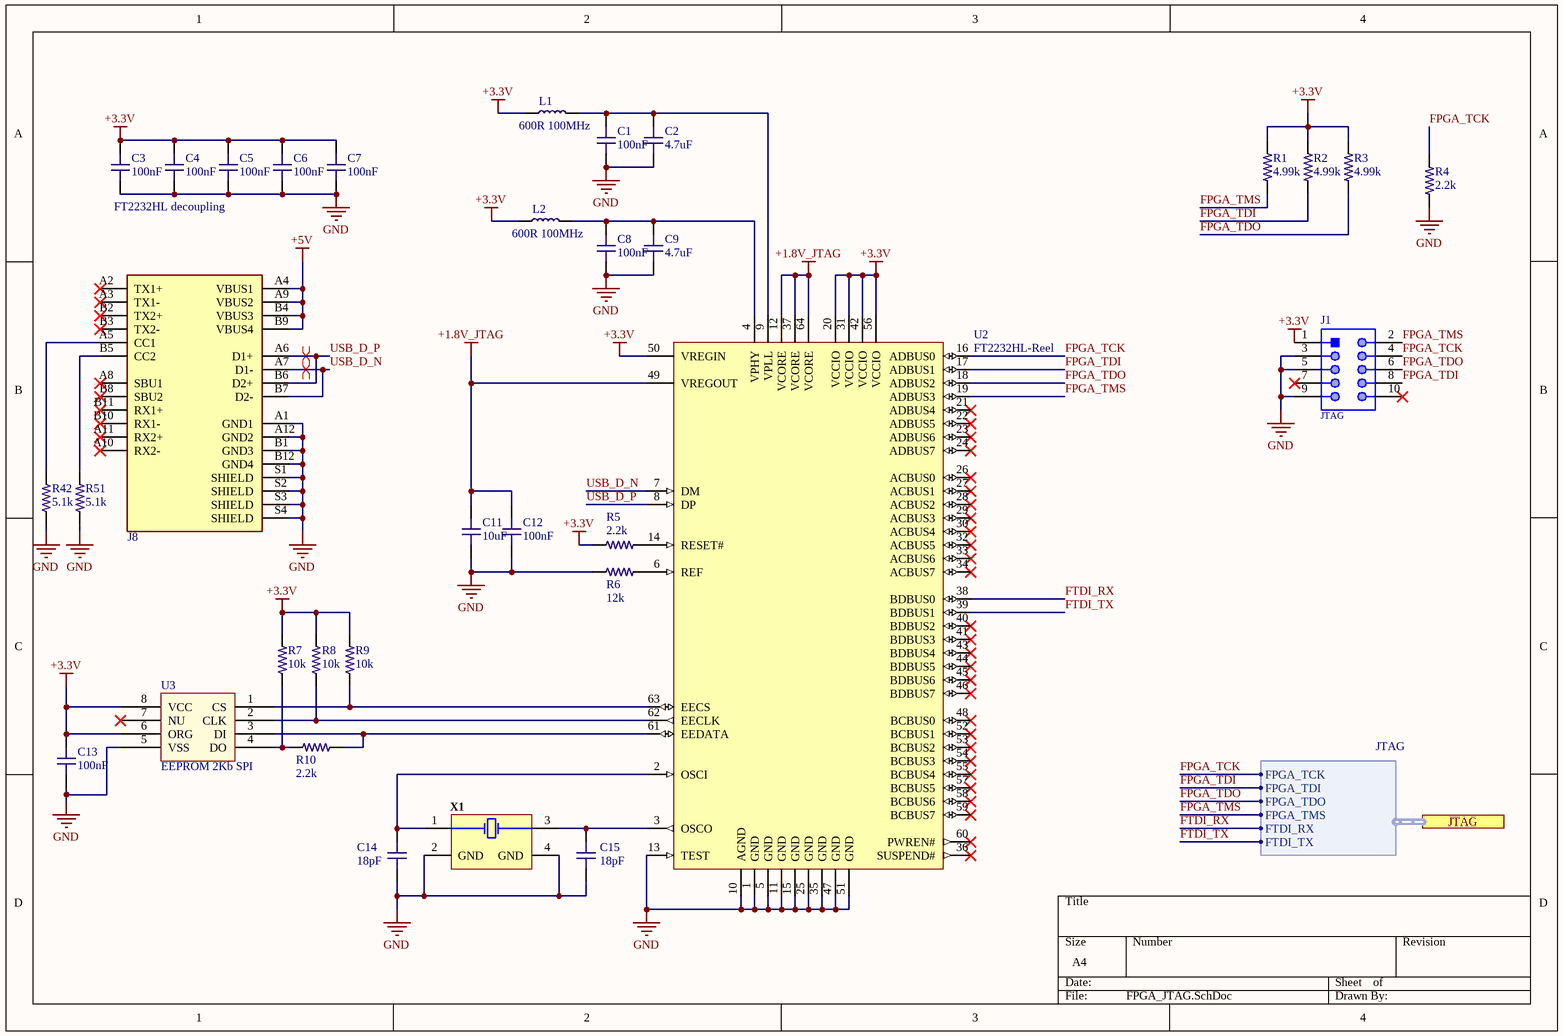
[diagram p4: FPGA_JTAG.SchDoc]

### Parts
C1  value 100nF  [C0603-HIGH-DENSITY]  (hidden comment: C0603 100nF 25V X7R)
C2  value 4.7uF  [C0603-HIGH-DENSITY]  (hidden comment: C0603 4.7uF 6.3V X5R)
C3  value 100nF  [C0603-HIGH-DENSITY]  (hidden comment: C0603 100nF 25V X7R)
C4  value 100nF  [C0603-HIGH-DENSITY]  (hidden comment: C0603 100nF 25V X7R)
C5  value 100nF  [C0603-HIGH-DENSITY]  (hidden comment: C0603 100nF 25V X7R)
C6  value 100nF  [C0603-HIGH-DENSITY]  (hidden comment: C0603 100nF 25V X7R)
C7  value 100nF  [C0603-HIGH-DENSITY]  (hidden comment: C0603 100nF 25V X7R)
C8  value 100nF  [C0603-HIGH-DENSITY]  (hidden comment: C0603 100nF 25V X7R)
C9  value 4.7uF  [C0603-HIGH-DENSITY]  (hidden comment: C0603 4.7uF 6.3V X5R)
C11  value 10uF  [C0603-HIGH-DENSITY]  (hidden comment: C0603 10uF 10V X5R)
C12  value 100nF  [C0603-HIGH-DENSITY]  (hidden comment: C0603 100nF 25V X7R)
C13  value 100nF  [C0603-HIGH-DENSITY]  (hidden comment: C0603 100nF 25V X7R)
C14  value 18pF  [C0603-HIGH-DENSITY]  (hidden comment: C0603 18pF 50V C0G_1)
C15  value 18pF  [C0603-HIGH-DENSITY]  (hidden comment: C0603 18pF 50V C0G_1)
J1  JTAG  [61201021621]
J8  USB C  [Molex USB-C]  (value not drawn)
L1  value 600R 100MHz  [L0603]  (hidden comment: Ferrite Bead)
L2  value 600R 100MHz  [L0603]  (hidden comment: Ferrite Bead)
R1  value 4.99k  [R0603-HIGH-DENSITY]  (hidden comment: R0603 4.99K 0.1%)
R2  value 4.99k  [R0603-HIGH-DENSITY]  (hidden comment: R0603 4.99K 0.1%)
R3  value 4.99k  [R0603-HIGH-DENSITY]  (hidden comment: R0603 4.99K 0.1%)
R4  value 2.2k  [R0603-HIGH-DENSITY]  (hidden comment: R0603 2.2K 1%)
R5  value 2.2k  [R0603-HIGH-DENSITY]  (hidden comment: R0603 2.2K 1%)
R6  value 12k  [R0603-HIGH-DENSITY]  (hidden comment: R0603 12k 1%)
R7  value 10k  [R0603-IPC]  (hidden comment: R0603 10K 1%)
R8  value 10k  [R0603-IPC]  (hidden comment: R0603 10K 1%)
R9  value 10k  [R0603-IPC]  (hidden comment: R0603 10K 1%)
R10  value 2.2k  [R0603-IPC]  (hidden comment: R0603 2.2K 1%)
R42  value 5.1k  [R0603-IPC-5.1K]  (hidden comment: R0603 5.1K 1%)
R51  value 5.1k  [R0603-IPC-5.1K]  (hidden comment: R0603 5.1K 1%)
U2  FT2232HL-Reel  [LQFP-64_M]
U3  EEPROM 2Kb SPI  [SOIC127P600X175-8N]
X1  ABM8G-12.000MHZ-18-D2Y-T  [ABRACON_ABM8G_V]  (value not drawn)

### Ports
JTAG (harness JTAG)

### Harnesses
JTAG: FPGA_TCK, FPGA_TDI, FPGA_TDO, FPGA_TMS, FTDI_RX, FTDI_TX

### Nets
+1.8V_JTAG: C11.2 C12.2 U2.12(VCORE) U2.37(VCORE) U2.49(VREGOUT) U2.64(VCORE)
+3.3V: C3.2 C4.2 C5.2 C6.2 C7.2 C13.2 J1.1 L1.1 L2.1 R1.2 R2.2 R3.2 R5.2 R7.2 R8.2 R9.2 U2.20(VCCIO) U2.31(VCCIO) U2.42(VCCIO) U2.50(VREGIN) U2.56(VCCIO) U3.6(ORG) U3.8(VCC)
+5V: J8.A4(VBUS1) J8.A9(VBUS2) J8.B4(VBUS3) J8.B9(VBUS4)
GND: C1.1 C2.1 C3.1 C4.1 C5.1 C6.1 C7.1 C8.1 C9.1 C11.1 C12.1 C13.1 C14.1 C15.1 J1.3 J1.5 J1.9 J8.A1(GND1) J8.A12(GND2) J8.B1(GND3) J8.B12(GND4) J8.S1(SHIELD) J8.S2(SHIELD) J8.S3(SHIELD) J8.S4(SHIELD) R4.1 R6.1 R42.1 R51.1 U2.1(GND) U2.5(GND) U2.10(AGND) U2.11(GND) U2.13(TEST) U2.15(GND) U2.25(GND) U2.35(GND) U2.47(GND) U2.51(GND) U3.5(VSS) X1.2(GND) X1.4(GND)
FPGA_TCK: J1.4 R4.2 U2.16(ADBUS0) ; port JTAG.FPGA_TCK
FPGA_TDI: J1.8 R2.1 U2.17(ADBUS1) ; port JTAG.FPGA_TDI
FPGA_TDO: J1.6 R3.1 U2.18(ADBUS2) ; port JTAG.FPGA_TDO
FPGA_TMS: J1.2 R1.1 U2.19(ADBUS3) ; port JTAG.FPGA_TMS
FTDI_RX: U2.38(BDBUS0) ; port JTAG.FTDI_RX
FTDI_TX: U2.39(BDBUS1) ; port JTAG.FTDI_TX
USB_D_N: J8.A7(D1-) J8.B7(D2-) U2.7(DM)
USB_D_P: J8.A6(D1+) J8.B6(D2+) U2.8(DP)
NetC1_2: C1.2 C2.2 L1.2 U2.9(VPLL)
NetC8_2: C8.2 C9.2 L2.2 U2.4(VPHY)
NetC14_2: C14.2 U2.2(OSCI) X1.1(X1)
NetC15_2: C15.2 U2.3(OSCO) X1.3(X2)
NetJ8_A5: J8.A5(CC1) R42.2
NetJ8_B5: J8.B5(CC2) R51.2
NetR5_1: R5.1 U2.14(RESET#)
NetR6_2: R6.2 U2.6(REF)
NetR7_1: R7.1 R10.2 U3.4(DO)
NetR8_1: R8.1 U2.62(EECLK) U3.2(CLK)
NetR9_1: R9.1 U2.63(EECS) U3.1(CS)
NetR10_1: R10.1 U2.61(EEDATA) U3.3(DI)

Not connected (* = marked no-connect by the designer): J1 7* 10*; J8 A2(TX1+)* A3(TX1-)* A8(SBU1)* A10(RX2-)* A11(RX2+)* B2(TX2+)* B3(TX2-)* B8(SBU2)* B10(RX1-)* B11(RX1+)*; U2 21(ADBUS4)* 22(ADBUS5)* 23(ADBUS6)* 24(ADBUS7)* 26(ACBUS0)* 27(ACBUS1)* 28(ACBUS2)* 29(ACBUS3)* 30(ACBUS4)* 32(ACBUS5)* 33(ACBUS6)* 34(ACBUS7)* 36(SUSPEND#)* 40(BDBUS2)* 41(BDBUS3)* 43(BDBUS4)* 44(BDBUS5)* 45(BDBUS6)* 46(BDBUS7)* 48(BCBUS0)* 52(BCBUS1)* 53(BCBUS2)* 54(BCBUS3)* 55(BCBUS4)* 57(BCBUS5)* 58(BCBUS6)* 59(BCBUS7)* 60(PWREN#)*; U3 7(NU)*

### Layout directives
differential pair; differential pair class USB: USB_D_N, USB_D_P

### Notes on the sheet
- FT2232HL decoupling

### Library data of the parts
C1 C3-C8 C12 C13 = C0603 100nF 25V X7R: Chip Capacitor, 0603, 100nF, 25V, X7R; EIA Code: X7R; Max. Voltage: 25V; Supplier 1: Digi-Key; Supplier Part Number 1: 490-1524-1-ND
C2 C9 = C0402 4.7uF 6.3V X5R: Chip Capacitor, 0603, 4.7uF, 10V, X5R; EIA Code: X5R; Max. Voltage: 10V; Supplier 1: Digi-Key; Supplier Part Number 1: 1276-1907-1-ND
C11 = C0603 10uF 10V X5R: as C18 on sheet FPGA_Power; Max. Voltage: 10V; Supplier 1: Digi-Key; Supplier Part Number 1: 490-10474-1-ND
C14 C15 = C0402 18pF 50V C0G_1: Chip Capacitor, 0603, 18pF, 25V, C0G; Max. Voltage: 25V; Supplier 1: Digi-Key; Supplier Part Number 1: 399-9019-1-ND; EIA Code: C0G
J1 = CMP-1502-00007-1: Male Box Header WR-BHD, THT, Vertical, pitch 2.54 mm, 10 pins; Manufacturer: Wurth Elektronik; Contact Resistance: 20mOhm; Withstanding Voltage: 500VAC; Pin Number: 10; Working Voltage: 250VAC; Pitch: 2.54mm; Mounting Technology: THT; Operating Temperature: -40to125degC; Published Date: August2018; Gender: Male; Packaging: Tray; Manufacturer URL: http://www.we-online.de; Datasheet URL: https://katalog.we-online.de/em/datasheet/6120xx21621.pdf; Orientation: Vertical; Package Reference: 61201021621; Part Number: 61201021621; Publisher: WurthElektronik
J8 = USB C: USB-C USB 3.1 Gen 2, Superspeed+_ Receptacle Connector 24 Position Surface Mount, Right Angle; Through Hole; MF: Molex; MP: 1054500101; Package: None; Digi-Key_Part_Number: WM12856CT-ND; SnapEDA_Link: https://www.snapeda.com/parts/1054500101/Molex/view-part/448528/?ref=snap; Digi-Key_Purchase_URL: https://www.digikey.tw/product-detail/en/molex/1054500101/WM12856CT-ND/5843891?utm_source=snapeda&utm_medium=aggregator&utm_campaign=symbol; Value: *; Supplier 1: Digi-Key; Supplier 2: Mouser; Supplier 3: LCSC; Supplier Part Number 1: WM12856CT-ND; Supplier Part Number 2: 538-105450-0101; Supplier Part Number 3: C134092
L1 L2 = FB 0603 600R @ 100MHz: as L4 on sheet FPGA_Power; Supplier 1: Digi-Key; Supplier Part Number 1: 490-1014-1-ND
R1-R3 = R0603 4.99K 0.1%: RES SMD 4.99KOHM 0.1% 1/10W 0603; Temperature Coefficient: ±25ppm/°C; Tolerance: ±0.1%; Features: Automotive AEC-Q200; Operating Temperature: -55°C ~ 155°C; Supplier 1: Digi-Key; Supplier Part Number 1: P4.99KDBCT-ND
R4 R5 R10 = R0603 2.2K 1%: RES SMD 2.2K OHM 1% 1/10W 0603; Temperature Coefficient: ±100ppm/°C; Features: Automotive AEC-Q200; Operating Temperature: -55°C ~ 155°C; Supplier 1: Digi-Key; Supplier Part Number 1: RMCF0603FT2K20CT-ND
R6 = R0603 12k 1%: RES 12K OHM 1% 1/10W 0603; Supplier 1: Digi-Key; Supplier Part Number 1: 541-12.0KHCT-ND
R7-R9 = R0603 10K 1%: RES SMD 10K OHM 1% 1/10W 0603; Supplier 1: Digi-Key; Supplier Part Number 1: RMCF0603FT10K0CT-ND
R42 R51 = R0603 5.1K 1%: RES SMD 5.1K OHM 1% 1/10W 0603; Temperature Coefficient: ±100ppm/°C; Features: Automotive AEC-Q200; Operating Temperature: -55°C ~ 155°C; Supplier 1: Digi-Key; Supplier Part Number 1: RMCF0603FT5K10CT-ND
U2 = CMP-0078-00023-3: Dual High Speed USB To Multipurpose UART/FIFO IC, 64-pin LQFP, Tape and Reel; Manufacturer: FTDI; DatasheetVersion: ver 2.21, Jun-2012; ComponentLink1URL: http://www.ftdichip.com/; PartNumber: FT2232HL-Reel; ComponentLink2Description: Datasheet; RevisionNote: DatasheetVersion updated to 2.21 Jun-2012; PackageVersion: Jun-12; ComponentLink1Description: Manufacturer URL; ComponentLink2URL: http://www.ftdichip.com/Support/Documents/DataSheets/ICs/DS_FT2232H.pdf; PackageReference: LQFP-64; PackageDescription: 64-Pin Thin Quad Flat Pack, 10 x 10 x 1.4 mm Body, 0.5 mm Pitch
U3 = 93LC56C-I/SN: EEPROM Memory IC 2Kb (256 x 8, 128 x 16) SPI 3MHz 8-SOIC; Supplier 1: Digi-Key; Supplier Part Number 1: 93LC56C-I/SN-ND
X1 = CMP-2000-05039-1: Ultra Miniature Ceramic Glass Sealed SMD Cryastal, 12 MHz, 18 pF, +/- 20 ppm, -40 to 85 degC, 4-Pin SMD, RoHS, Tape and Reel; Brand: ABRACON; ESR: 120Ohms; Case Length: 3.2mm; Tolerance: 20PPM; Frequency: 12MHz; Frequency Stability: 30PPM; Case Height: 1mm; Case Width: 2.5mm; Load Capacitance: 18pF; Termination Style: SMD/SMT; Mounting Style: SMD/SMT; Factory Pack Quantity: 1000; Series: ABM8G; Datasheet Version: Apr-17; Manufacturer: ABRACON; Packaging: Reel; Manufacturer URL: http://www.abracon.com/; RoHS: Details; Package / Case: 3.2mmx2.5mm; Type: UltraMiniatureGlassSealedCrystal; Datasheet URL: https://datasheet.ciiva.com/15116/getdatasheetpartid-719790-15116701.pdf; Operating Temperature Range: -40Cto+85C; Product Category: Crystals; Dimensions: 2.5mmWx3.2mmLx1mmH

## Sheet FPGA_ADC_TOP.SchDoc
size A4
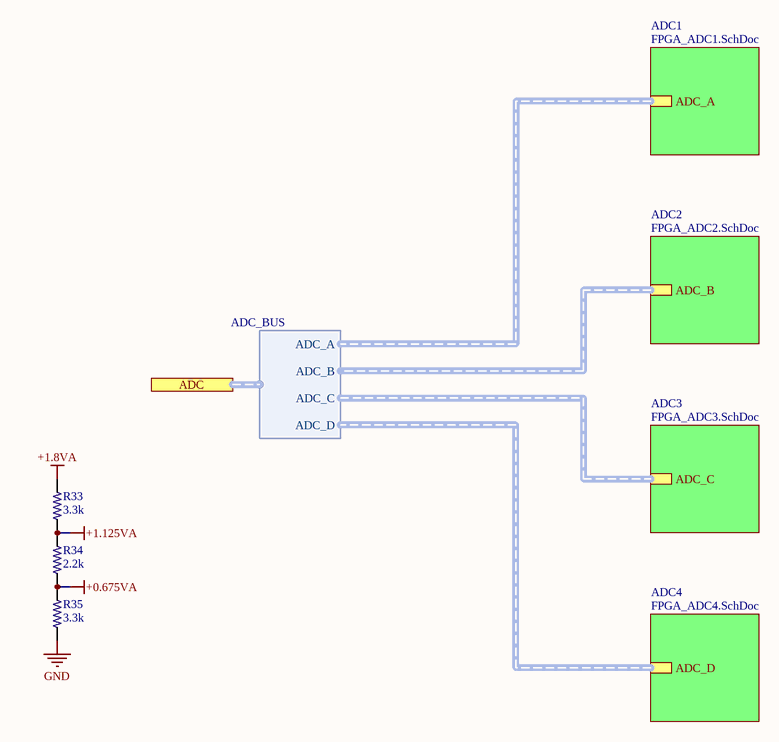
[diagram p5: FPGA_ADC_TOP.SchDoc]

### Parts
R33  value 3.3k  [R0603-HIGH-DENSITY]  (hidden comment: R0603 3.3k 1%)
R34  value 2.2k  [R0603-HIGH-DENSITY]  (hidden comment: R0603 2.2K 1%)
R35  value 3.3k  [R0603-HIGH-DENSITY]  (hidden comment: R0603 3.3k 1%)

### Sub-sheets
ADC1 = FPGA_ADC1.SchDoc: ADC_A (harness ADC)
ADC2 = FPGA_ADC2.SchDoc: ADC_B (harness ADC)
ADC3 = FPGA_ADC3.SchDoc: ADC_C (harness ADC)
ADC4 = FPGA_ADC4.SchDoc: ADC_D (harness ADC)

### Ports
ADC (harness ADC_BUS)

### Harnesses
ADC_BUS: ADC_A, ADC_B, ADC_C, ADC_D

### Nets
+0.675VA: R34.1 R35.2
+1.8VA: R33.2
+1.125VA: R33.1 R34.2
GND: R35.1

### Library data of the parts
R33 R35 = R0603 3.3k 1%: Chip Resistor, 0603, 3.3k ohms, 0.1W; Supplier 1: Digi-Key; Supplier Part Number 1: RMCF0603FT3K30CT-ND
R34 = R0603 2.2K 1%: as R4 on sheet FPGA_JTAG; Features: Automotive AEC-Q200; Operating Temperature: -55°C ~ 155°C; Supplier 1: Digi-Key; Supplier Part Number 1: RMCF0603FT2K20CT-ND

## Sheet FPGA_ADC1.SchDoc
size A4
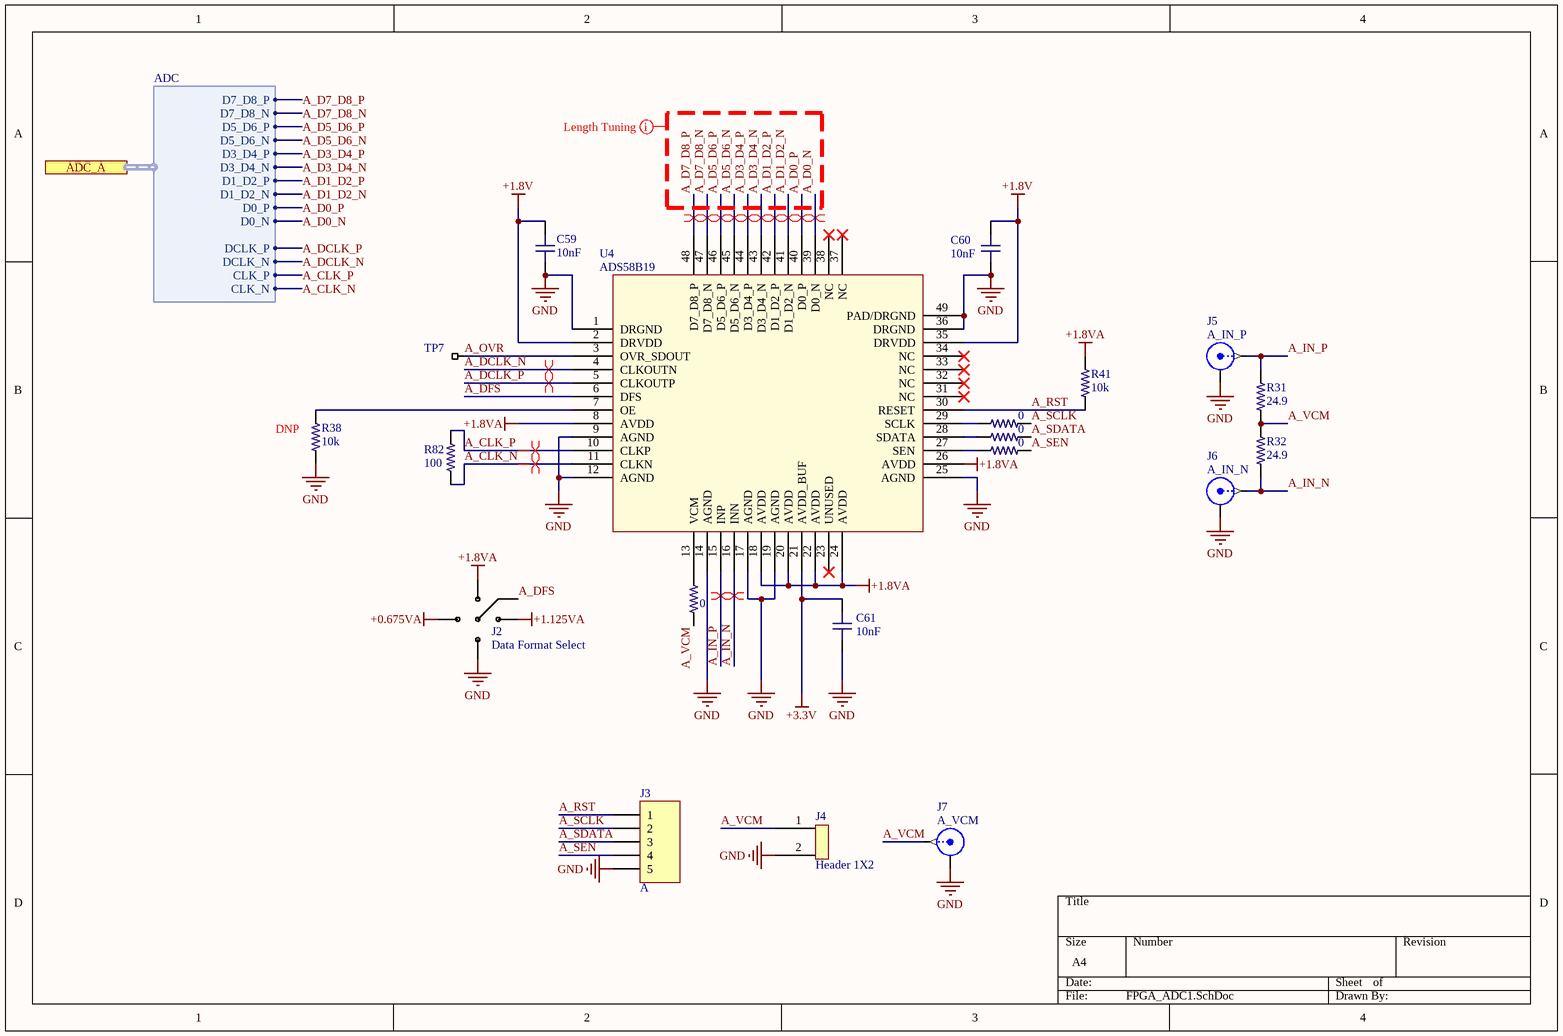
[diagram p6: FPGA_ADC1.SchDoc]

### Parts
C59  value 10nF  [C0603-HIGH-DENSITY]  (hidden comment: C0603 10nF 50V X7R)
C60  value 10nF  [C0603-HIGH-DENSITY]  (hidden comment: C0603 10nF 50V X7R)
C61  value 10nF  [C0603-HIGH-DENSITY]  (hidden comment: C0603 10nF 50V X7R)
J2  Data Format Select  [4P Jumper]
J3  A  [HDR1X5]
J4  Header 1X2  [Header 1x2 TH Pitch 2.54mm]
J5  A_IN_P  [SMA Edge Launch (Horizontal)]
J6  A_IN_N  [SMA Edge Launch (Horizontal)]
J7  A_VCM  [SMA_CONN]
R31  value 24.9  [R0603-HIGH-DENSITY]  (hidden comment: RC0603FR-0724R9L)
R32  value 24.9  [R0603-HIGH-DENSITY]  (hidden comment: RC0603FR-0724R9L)
R36  value 0  [R0603-IPC]  (hidden comment: R0603 0)
R37  value 0  [R0603-IPC]  (hidden comment: R0603 0)
R38  value 10k  [R0603-IPC-10K]  (hidden comment: R0603 10K 1%)
R39  value 0  [R0603-IPC]  (hidden comment: R0603 0)
R40  value 0  [R0603-IPC]  (hidden comment: R0603 0)
R41  value 10k  [R0603-IPC-10K]  (hidden comment: R0603 10K 1%)
R82  value 100  [R0402-HIGH-DENSITY]  (hidden comment: R0402 100R 1%)
TP7  Testpoint_SMT  [TESTPOINT_SMT]  (value not drawn)  (no BOM)
U4  ADS58B19  [VQFN48]

### Ports
ADC_A (harness ADC)

### Harnesses
ADC: D7_D8_P, D7_D8_N, D5_D6_P, D5_D6_N, D3_D4_P, D3_D4_N, D1_D2_P, D1_D2_N, D0_P, D0_N, CLK_P, CLK_N, DCLK_P, DCLK_N

### Nets
+0.675VA: J2.4
+1.8V: C59.1 C60.1 U4.2(DRVDD) U4.35(DRVDD)
+1.8VA: J2.1 R41.2 U4.8(AVDD) U4.18(AVDD) U4.20(AVDD) U4.22(AVDD) U4.24(AVDD) U4.26(AVDD)
+1.125VA: J2.2
+3.3V: C61.1 U4.21(AVDD_BUF)
GND: C59.2 C60.2 C61.2 J2.3 J3.5 J4.2 J5.2(Y) J6.2(Y) J7.G(Y) R38.1 U4.1(DRGND) U4.9(AGND) U4.12(AGND) U4.14(AGND) U4.17(AGND) U4.19(AGND) U4.25(AGND) U4.36(DRGND) U4.49(PAD/DRGND)
A_CLK_N: R82.1 U4.11(CLKN) ; port ADC_A.CLK_N
A_CLK_P: R82.2 U4.10(CLKP) ; port ADC_A.CLK_P
A_D0_N: U4.39(D0_N) ; port ADC_A.D0_N
A_D0_P: U4.40(D0_P) ; port ADC_A.D0_P
A_D1_D2_N: U4.41(D1_D2_N) ; port ADC_A.D1_D2_N
A_D1_D2_P: U4.42(D1_D2_P) ; port ADC_A.D1_D2_P
A_D3_D4_N: U4.43(D3_D4_N) ; port ADC_A.D3_D4_N
A_D3_D4_P: U4.44(D3_D4_P) ; port ADC_A.D3_D4_P
A_D5_D6_N: U4.45(D5_D6_N) ; port ADC_A.D5_D6_N
A_D5_D6_P: U4.46(D5_D6_P) ; port ADC_A.D5_D6_P
A_D7_D8_N: U4.47(D7_D8_N) ; port ADC_A.D7_D8_N
A_D7_D8_P: U4.48(D7_D8_P) ; port ADC_A.D7_D8_P
A_DCLK_N: U4.4(CLKOUTN) ; port ADC_A.DCLK_N
A_DCLK_P: U4.5(CLKOUTP) ; port ADC_A.DCLK_P
A_DFS: J2.5 U4.6(DFS)
A_IN_N: J6.1(X) R32.1 U4.16(INN)
A_IN_P: J5.1(X) R31.2 U4.15(INP)
A_OVR: TP7.1 U4.3(OVR_SDOUT)
A_RST: J3.1 R41.1 U4.30(RESET)
A_SCLK: J3.2 R36.2
A_SDATA: J3.3 R37.2
A_SEN: J3.4 R39.2
A_VCM: J4.1 J7.C(X) R31.1 R32.2 R40.2
NetR36_1: R36.1 U4.29(SCLK)
NetR37_1: R37.1 U4.28(SDATA)
NetR38_2: R38.2 U4.7(OE)
NetR39_1: R39.1 U4.27(SEN)
NetR40_1: R40.1 U4.13(VCM)

Not connected (* = marked no-connect by the designer): U4 23(UNUSED)* 31(NC)* 32(NC)* 33(NC)* 34(NC)* 37(NC)* 38(NC)*

### Layout directives
differential pair: A_D0_N, A_D0_P, A_D1_D2_N, A_D1_D2_P, A_D3_D4_N, A_D3_D4_P, A_D5_D6_N, A_D5_D6_P, A_D7_D8_N, A_D7_D8_P
differential pair; differential pair class AnalogIn: A_IN_N, A_IN_P
differential pair; differential pair class ADC_CLK: A_CLK_N, A_CLK_P, A_DCLK_N, A_DCLK_P
net class ADC_DATA - 150mil; net class ADC_DATA_A: A_D0_N, A_D0_P, A_D1_D2_N, A_D1_D2_P, A_D3_D4_N, A_D3_D4_P, A_D5_D6_N, A_D5_D6_P, A_D7_D8_N, A_D7_D8_P

### Notes on the sheet
- (near R38) DNP

### Library data of the parts
C59-C61 = C0603 10nF 50V X7R: CAP CER 10000PF 50V X7R 0603; EIA Code: X7R; Max. Voltage: 50V; Features: Soft Termination; Supplier 1: Digi-Key; Supplier Part Number 1: 490-10892-1-ND
J2 = 4P Jumper: 0603 4 Way Solder Jumper
J3 = Header 5: Header, 5-Pin; LatestRevisionDate: 17-Jul-2002; LatestRevisionNote: Re-released for DXP Platform.; Publisher: Altium Limited
J5-J7 = SMA: SMA Connector; Supplier 1: Digi-Key; Supplier Part Number 1: A97594-ND
R31 R32 = R0603 24.9R 1%: Chip Resistor, 0603, 24.9 ohms, 0.1W; Supplier 1: Digi-Key; Supplier 2: Mouser; Supplier Part Number 1: 311-24.9HRCT-ND; Supplier Part Number 2: 603-RC0603FR-0724R9L
R36 R37 R39 R40 = R0603 0: RES SMD 0 OHM JUMPER 1/10W 0603; Supplier 1: Digi-Key; Supplier Part Number 1: RMCF0603ZT0R00CT-ND
R38 R41 = R0603 10K 1%: RES SMD 10K OHM 1% 1/10W 0603; Supplier 1: Digi-Key; Supplier Part Number 1: RMCF0603FT10K0CT-ND
R82 = R0402 100R 1%: as R14 on sheet FPGA_FPGA; Supplier 1: Digi-Key; Supplier Part Number 1: 311-100LRCT-ND
TP7 = Testpoint_SMT: SMT Test Point
U4 = ADS58B19: Single ADC Pipelined 250Msps 9-bit Parallel/LVDS 48-Pin VQFN; Supplier 1: Digi-Key; Supplier 2: Mouser; Supplier Part Number 1: 296-28296-1-ND; Supplier Part Number 2: 595-ADS58B19IRGZT

## Sheet FPGA_ADC2.SchDoc
size A4
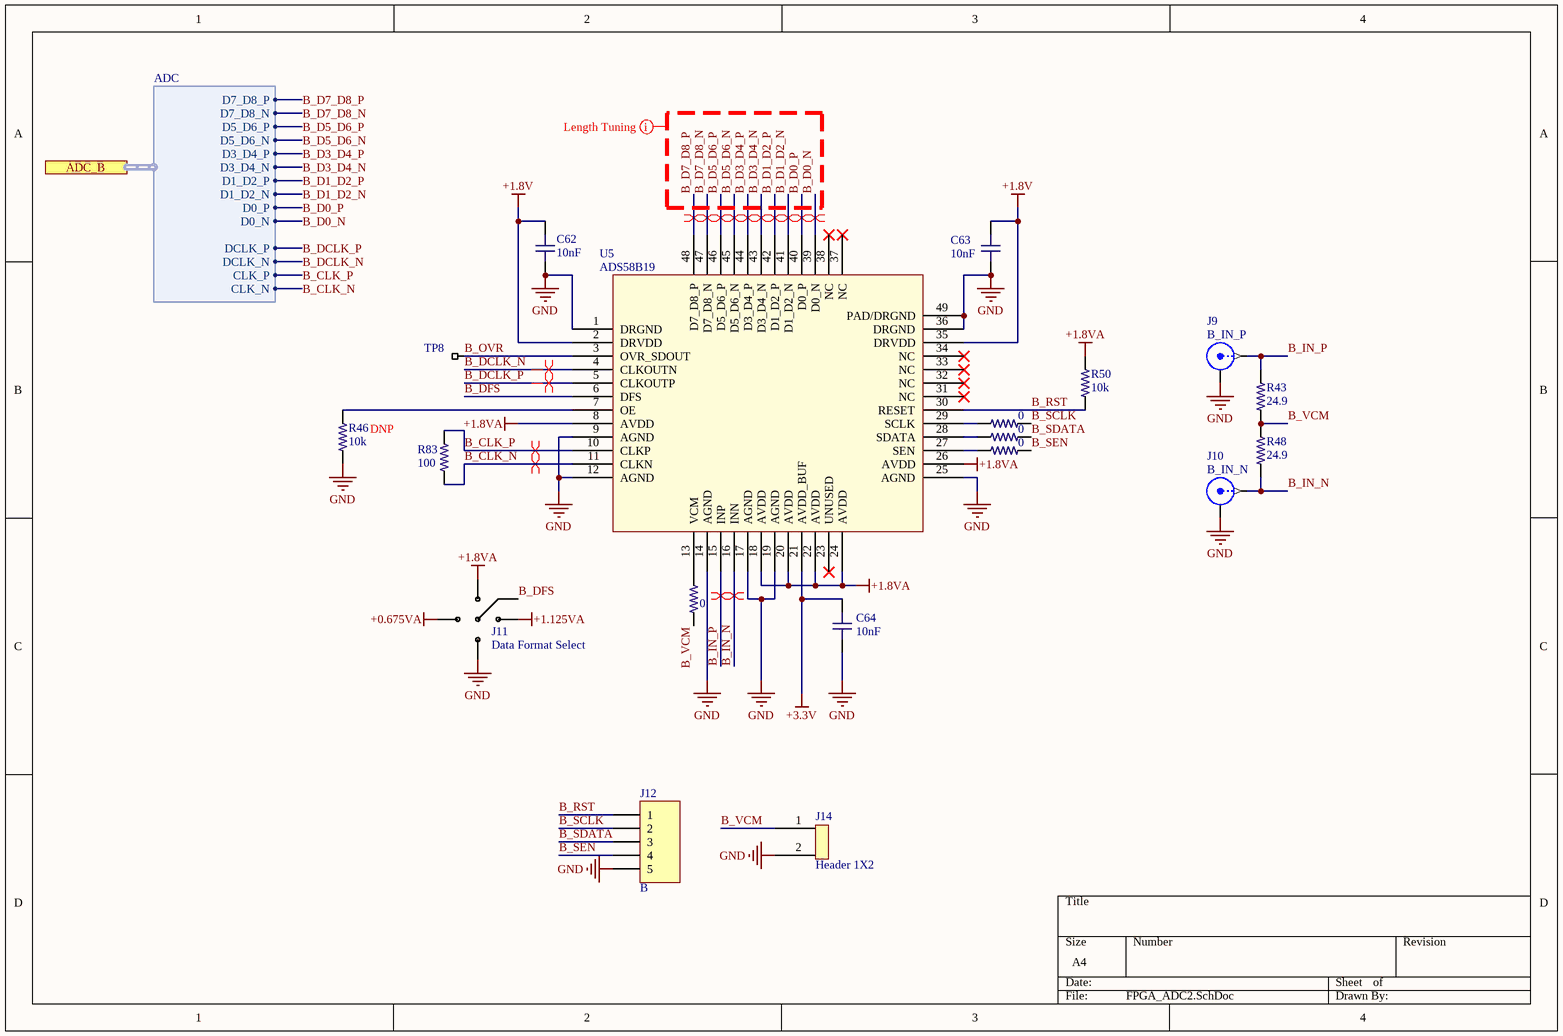
[diagram p7: FPGA_ADC2.SchDoc]

### Parts
C62  value 10nF  [C0603-HIGH-DENSITY]  (hidden comment: C0603 10nF 50V X7R)
C63  value 10nF  [C0603-HIGH-DENSITY]  (hidden comment: C0603 10nF 50V X7R)
C64  value 10nF  [C0603-HIGH-DENSITY]  (hidden comment: C0603 10nF 50V X7R)
J9  B_IN_P  [SMA Edge Launch (Horizontal)]
J10  B_IN_N  [SMA Edge Launch (Horizontal)]
J11  Data Format Select  [4P Jumper]
J12  B  [HDR1X5]
J14  Header 1X2  [Header 1x2 TH Pitch 2.54mm]
R43  value 24.9  [R0603-HIGH-DENSITY]  (hidden comment: RC0603FR-0724R9L)
R44  value 0  [R0603-IPC]  (hidden comment: R0603 0)
R45  value 0  [R0603-IPC]  (hidden comment: R0603 0)
R46  value 10k  [R0603-IPC-10K]  (hidden comment: R0603 10K 1%)
R47  value 0  [R0603-IPC]  (hidden comment: R0603 0)
R48  value 24.9  [R0603-HIGH-DENSITY]  (hidden comment: RC0603FR-0724R9L)
R49  value 0  [R0603-IPC]  (hidden comment: R0603 0)
R50  value 10k  [R0603-IPC-10K]  (hidden comment: R0603 10K 1%)
R83  value 100  [R0402-HIGH-DENSITY]  (hidden comment: R0402 100R 1%)
TP8  Testpoint_SMT  [TESTPOINT_SMT]  (value not drawn)  (no BOM)
U5  ADS58B19  [VQFN48]

### Ports
ADC_B (harness ADC)

### Harnesses
ADC: D7_D8_P, D7_D8_N, D5_D6_P, D5_D6_N, D3_D4_P, D3_D4_N, D1_D2_P, D1_D2_N, D0_P, D0_N, CLK_P, CLK_N, DCLK_P, DCLK_N

### Nets
+0.675VA: J11.4
+1.8V: C62.1 C63.1 U5.2(DRVDD) U5.35(DRVDD)
+1.8VA: J11.1 R50.2 U5.8(AVDD) U5.18(AVDD) U5.20(AVDD) U5.22(AVDD) U5.24(AVDD) U5.26(AVDD)
+1.125VA: J11.2
+3.3V: C64.1 U5.21(AVDD_BUF)
GND: C62.2 C63.2 C64.2 J9.2(Y) J10.2(Y) J11.3 J12.5 J14.2 R46.1 U5.1(DRGND) U5.9(AGND) U5.12(AGND) U5.14(AGND) U5.17(AGND) U5.19(AGND) U5.25(AGND) U5.36(DRGND) U5.49(PAD/DRGND)
B_CLK_N: R83.1 U5.11(CLKN) ; port ADC_B.CLK_N
B_CLK_P: R83.2 U5.10(CLKP) ; port ADC_B.CLK_P
B_D0_N: U5.39(D0_N) ; port ADC_B.D0_N
B_D0_P: U5.40(D0_P) ; port ADC_B.D0_P
B_D1_D2_N: U5.41(D1_D2_N) ; port ADC_B.D1_D2_N
B_D1_D2_P: U5.42(D1_D2_P) ; port ADC_B.D1_D2_P
B_D3_D4_N: U5.43(D3_D4_N) ; port ADC_B.D3_D4_N
B_D3_D4_P: U5.44(D3_D4_P) ; port ADC_B.D3_D4_P
B_D5_D6_N: U5.45(D5_D6_N) ; port ADC_B.D5_D6_N
B_D5_D6_P: U5.46(D5_D6_P) ; port ADC_B.D5_D6_P
B_D7_D8_N: U5.47(D7_D8_N) ; port ADC_B.D7_D8_N
B_D7_D8_P: U5.48(D7_D8_P) ; port ADC_B.D7_D8_P
B_DCLK_N: U5.4(CLKOUTN) ; port ADC_B.DCLK_N
B_DCLK_P: U5.5(CLKOUTP) ; port ADC_B.DCLK_P
B_DFS: J11.5 U5.6(DFS)
B_IN_N: J10.1(X) R48.1 U5.16(INN)
B_IN_P: J9.1(X) R43.2 U5.15(INP)
B_OVR: TP8.1 U5.3(OVR_SDOUT)
B_RST: J12.1 R50.1 U5.30(RESET)
B_SCLK: J12.2 R44.2
B_SDATA: J12.3 R45.2
B_SEN: J12.4 R47.2
B_VCM: J14.1 R43.1 R48.2 R49.2
NetR44_1: R44.1 U5.29(SCLK)
NetR45_1: R45.1 U5.28(SDATA)
NetR46_2: R46.2 U5.7(OE)
NetR47_1: R47.1 U5.27(SEN)
NetR49_1: R49.1 U5.13(VCM)

Not connected (* = marked no-connect by the designer): U5 23(UNUSED)* 31(NC)* 32(NC)* 33(NC)* 34(NC)* 37(NC)* 38(NC)*

### Layout directives
differential pair: B_D0_N, B_D0_P, B_D1_D2_N, B_D1_D2_P, B_D3_D4_N, B_D3_D4_P, B_D5_D6_N, B_D5_D6_P, B_D7_D8_N, B_D7_D8_P
differential pair; differential pair class AnalogIn: B_IN_N, B_IN_P
differential pair; differential pair class ADC_CLK: B_CLK_N, B_CLK_P, B_DCLK_N, B_DCLK_P
net class ADC_DATA - 150mil; net class ADC_DATA_B: B_D0_N, B_D0_P, B_D1_D2_N, B_D1_D2_P, B_D3_D4_N, B_D3_D4_P, B_D5_D6_N, B_D5_D6_P, B_D7_D8_N, B_D7_D8_P

### Notes on the sheet
- (near R46) DNP

### Library data of the parts
C62-C64 = C0603 10nF 50V X7R: CAP CER 10000PF 50V X7R 0603; EIA Code: X7R; Max. Voltage: 50V; Features: Soft Termination; Supplier 1: Digi-Key; Supplier Part Number 1: 490-10892-1-ND
J9 J10 = SMA: SMA Connector; Supplier 1: Digi-Key; Supplier Part Number 1: A97594-ND
J11 = 4P Jumper: 0603 4 Way Solder Jumper
J12 = Header 5: Header, 5-Pin; LatestRevisionDate: 17-Jul-2002; LatestRevisionNote: Re-released for DXP Platform.; Publisher: Altium Limited
R43 R48 = R0603 24.9R 1%: Chip Resistor, 0603, 24.9 ohms, 0.1W; Supplier 1: Digi-Key; Supplier 2: Mouser; Supplier Part Number 1: 311-24.9HRCT-ND; Supplier Part Number 2: 603-RC0603FR-0724R9L
R44 R45 R47 R49 = R0603 0: RES SMD 0 OHM JUMPER 1/10W 0603; Supplier 1: Digi-Key; Supplier Part Number 1: RMCF0603ZT0R00CT-ND
R46 R50 = R0603 10K 1%: RES SMD 10K OHM 1% 1/10W 0603; Supplier 1: Digi-Key; Supplier Part Number 1: RMCF0603FT10K0CT-ND
R83 = R0402 100R 1%: as R14 on sheet FPGA_FPGA; Supplier 1: Digi-Key; Supplier Part Number 1: 311-100LRCT-ND
TP8 = Testpoint_SMT: SMT Test Point
U5 = ADS58B19: as U4 on sheet FPGA_ADC1; Supplier 1: Digi-Key; Supplier 2: Mouser; Supplier Part Number 1: 296-28296-1-ND; Supplier Part Number 2: 595-ADS58B19IRGZT

## Sheet FPGA_ADC3.SchDoc
size A4
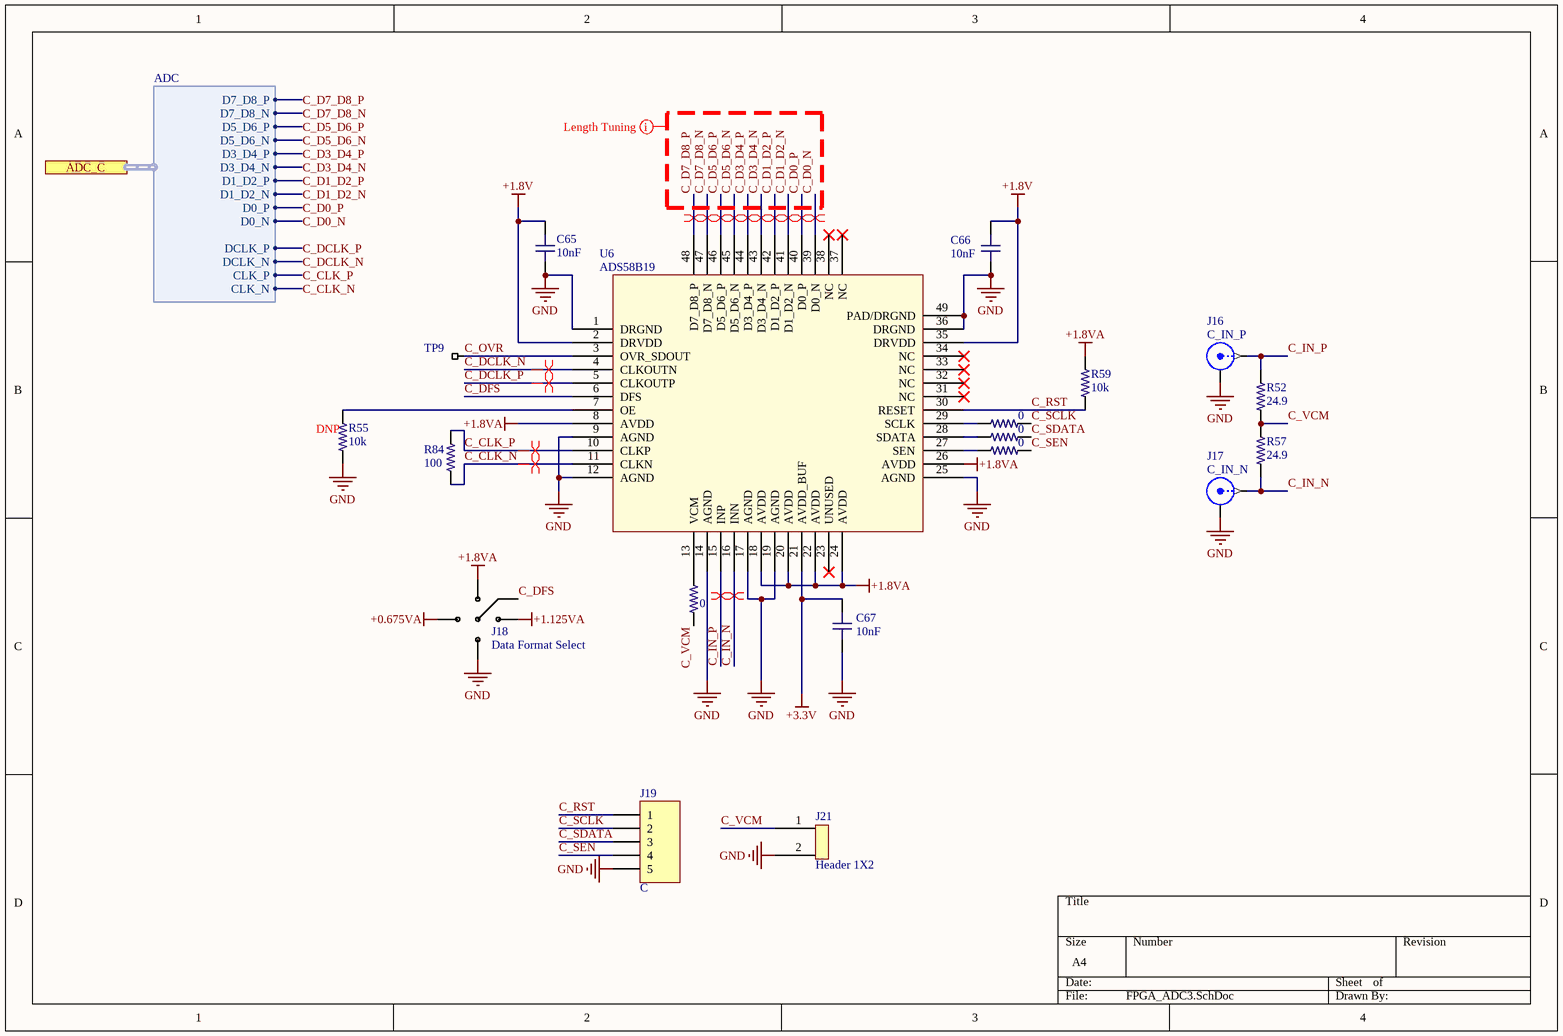
[diagram p8: FPGA_ADC3.SchDoc]

### Parts
C65  value 10nF  [C0603-HIGH-DENSITY]  (hidden comment: C0603 10nF 50V X7R)
C66  value 10nF  [C0603-HIGH-DENSITY]  (hidden comment: C0603 10nF 50V X7R)
C67  value 10nF  [C0603-HIGH-DENSITY]  (hidden comment: C0603 10nF 50V X7R)
J16  C_IN_P  [SMA Edge Launch (Horizontal)]
J17  C_IN_N  [SMA Edge Launch (Horizontal)]
J18  Data Format Select  [4P Jumper]
J19  C  [HDR1X5]
J21  Header 1X2  [Header 1x2 TH Pitch 2.54mm]
R52  value 24.9  [R0603-HIGH-DENSITY]  (hidden comment: RC0603FR-0724R9L)
R53  value 0  [R0603-IPC]  (hidden comment: R0603 0)
R54  value 0  [R0603-IPC]  (hidden comment: R0603 0)
R55  value 10k  [R0603-IPC-10K]  (hidden comment: R0603 10K 1%)
R56  value 0  [R0603-IPC]  (hidden comment: R0603 0)
R57  value 24.9  [R0603-HIGH-DENSITY]  (hidden comment: RC0603FR-0724R9L)
R58  value 0  [R0603-IPC]  (hidden comment: R0603 0)
R59  value 10k  [R0603-IPC-10K]  (hidden comment: R0603 10K 1%)
R84  value 100  [R0402-HIGH-DENSITY]  (hidden comment: R0402 100R 1%)
TP9  Testpoint_SMT  [TESTPOINT_SMT]  (value not drawn)  (no BOM)
U6  ADS58B19  [VQFN48]

### Ports
ADC_C (harness ADC)

### Harnesses
ADC: D7_D8_P, D7_D8_N, D5_D6_P, D5_D6_N, D3_D4_P, D3_D4_N, D1_D2_P, D1_D2_N, D0_P, D0_N, CLK_P, CLK_N, DCLK_P, DCLK_N

### Nets
+0.675VA: J18.4
+1.8V: C65.1 C66.1 U6.2(DRVDD) U6.35(DRVDD)
+1.8VA: J18.1 R59.2 U6.8(AVDD) U6.18(AVDD) U6.20(AVDD) U6.22(AVDD) U6.24(AVDD) U6.26(AVDD)
+1.125VA: J18.2
+3.3V: C67.1 U6.21(AVDD_BUF)
GND: C65.2 C66.2 C67.2 J16.2(Y) J17.2(Y) J18.3 J19.5 J21.2 R55.1 U6.1(DRGND) U6.9(AGND) U6.12(AGND) U6.14(AGND) U6.17(AGND) U6.19(AGND) U6.25(AGND) U6.36(DRGND) U6.49(PAD/DRGND)
C_CLK_N: R84.1 U6.11(CLKN) ; port ADC_C.CLK_N
C_CLK_P: R84.2 U6.10(CLKP) ; port ADC_C.CLK_P
C_D0_N: U6.39(D0_N) ; port ADC_C.D0_N
C_D0_P: U6.40(D0_P) ; port ADC_C.D0_P
C_D1_D2_N: U6.41(D1_D2_N) ; port ADC_C.D1_D2_N
C_D1_D2_P: U6.42(D1_D2_P) ; port ADC_C.D1_D2_P
C_D3_D4_N: U6.43(D3_D4_N) ; port ADC_C.D3_D4_N
C_D3_D4_P: U6.44(D3_D4_P) ; port ADC_C.D3_D4_P
C_D5_D6_N: U6.45(D5_D6_N) ; port ADC_C.D5_D6_N
C_D5_D6_P: U6.46(D5_D6_P) ; port ADC_C.D5_D6_P
C_D7_D8_N: U6.47(D7_D8_N) ; port ADC_C.D7_D8_N
C_D7_D8_P: U6.48(D7_D8_P) ; port ADC_C.D7_D8_P
C_DCLK_N: U6.4(CLKOUTN) ; port ADC_C.DCLK_N
C_DCLK_P: U6.5(CLKOUTP) ; port ADC_C.DCLK_P
C_DFS: J18.5 U6.6(DFS)
C_IN_N: J17.1(X) R57.1 U6.16(INN)
C_IN_P: J16.1(X) R52.2 U6.15(INP)
C_OVR: TP9.1 U6.3(OVR_SDOUT)
C_RST: J19.1 R59.1 U6.30(RESET)
C_SCLK: J19.2 R53.2
C_SDATA: J19.3 R54.2
C_SEN: J19.4 R56.2
C_VCM: J21.1 R52.1 R57.2 R58.2
NetR53_1: R53.1 U6.29(SCLK)
NetR54_1: R54.1 U6.28(SDATA)
NetR55_2: R55.2 U6.7(OE)
NetR56_1: R56.1 U6.27(SEN)
NetR58_1: R58.1 U6.13(VCM)

Not connected (* = marked no-connect by the designer): U6 23(UNUSED)* 31(NC)* 32(NC)* 33(NC)* 34(NC)* 37(NC)* 38(NC)*

### Layout directives
differential pair: C_D0_N, C_D0_P, C_D1_D2_N, C_D1_D2_P, C_D3_D4_N, C_D3_D4_P, C_D5_D6_N, C_D5_D6_P, C_D7_D8_N, C_D7_D8_P
differential pair; differential pair class AnalogIn: C_IN_N, C_IN_P
differential pair; differential pair class ADC_CLK: C_CLK_N, C_CLK_P, C_DCLK_N, C_DCLK_P
net class ADC_DATA - 150mil; net class ADC_DATA_C: C_D0_N, C_D0_P, C_D1_D2_N, C_D1_D2_P, C_D3_D4_N, C_D3_D4_P, C_D5_D6_N, C_D5_D6_P, C_D7_D8_N, C_D7_D8_P

### Notes on the sheet
- (near R55) DNP

### Library data of the parts
C65-C67 = C0603 10nF 50V X7R: CAP CER 10000PF 50V X7R 0603; EIA Code: X7R; Max. Voltage: 50V; Features: Soft Termination; Supplier 1: Digi-Key; Supplier Part Number 1: 490-10892-1-ND
J16 J17 = SMA: SMA Connector; Supplier 1: Digi-Key; Supplier Part Number 1: A97594-ND
J18 = 4P Jumper: 0603 4 Way Solder Jumper
J19 = Header 5: Header, 5-Pin; LatestRevisionDate: 17-Jul-2002; LatestRevisionNote: Re-released for DXP Platform.; Publisher: Altium Limited
R52 R57 = R0603 24.9R 1%: Chip Resistor, 0603, 24.9 ohms, 0.1W; Supplier 1: Digi-Key; Supplier 2: Mouser; Supplier Part Number 1: 311-24.9HRCT-ND; Supplier Part Number 2: 603-RC0603FR-0724R9L
R53 R54 R56 R58 = R0603 0: RES SMD 0 OHM JUMPER 1/10W 0603; Supplier 1: Digi-Key; Supplier Part Number 1: RMCF0603ZT0R00CT-ND
R55 R59 = R0603 10K 1%: RES SMD 10K OHM 1% 1/10W 0603; Supplier 1: Digi-Key; Supplier Part Number 1: RMCF0603FT10K0CT-ND
R84 = R0402 100R 1%: as R14 on sheet FPGA_FPGA; Supplier 1: Digi-Key; Supplier Part Number 1: 311-100LRCT-ND
TP9 = Testpoint_SMT: SMT Test Point
U6 = ADS58B19: as U4 on sheet FPGA_ADC1; Supplier 1: Digi-Key; Supplier 2: Mouser; Supplier Part Number 1: 296-28296-1-ND; Supplier Part Number 2: 595-ADS58B19IRGZT